# Altium project ESP32_Tang1.PrjPcb (part 1 of 2)
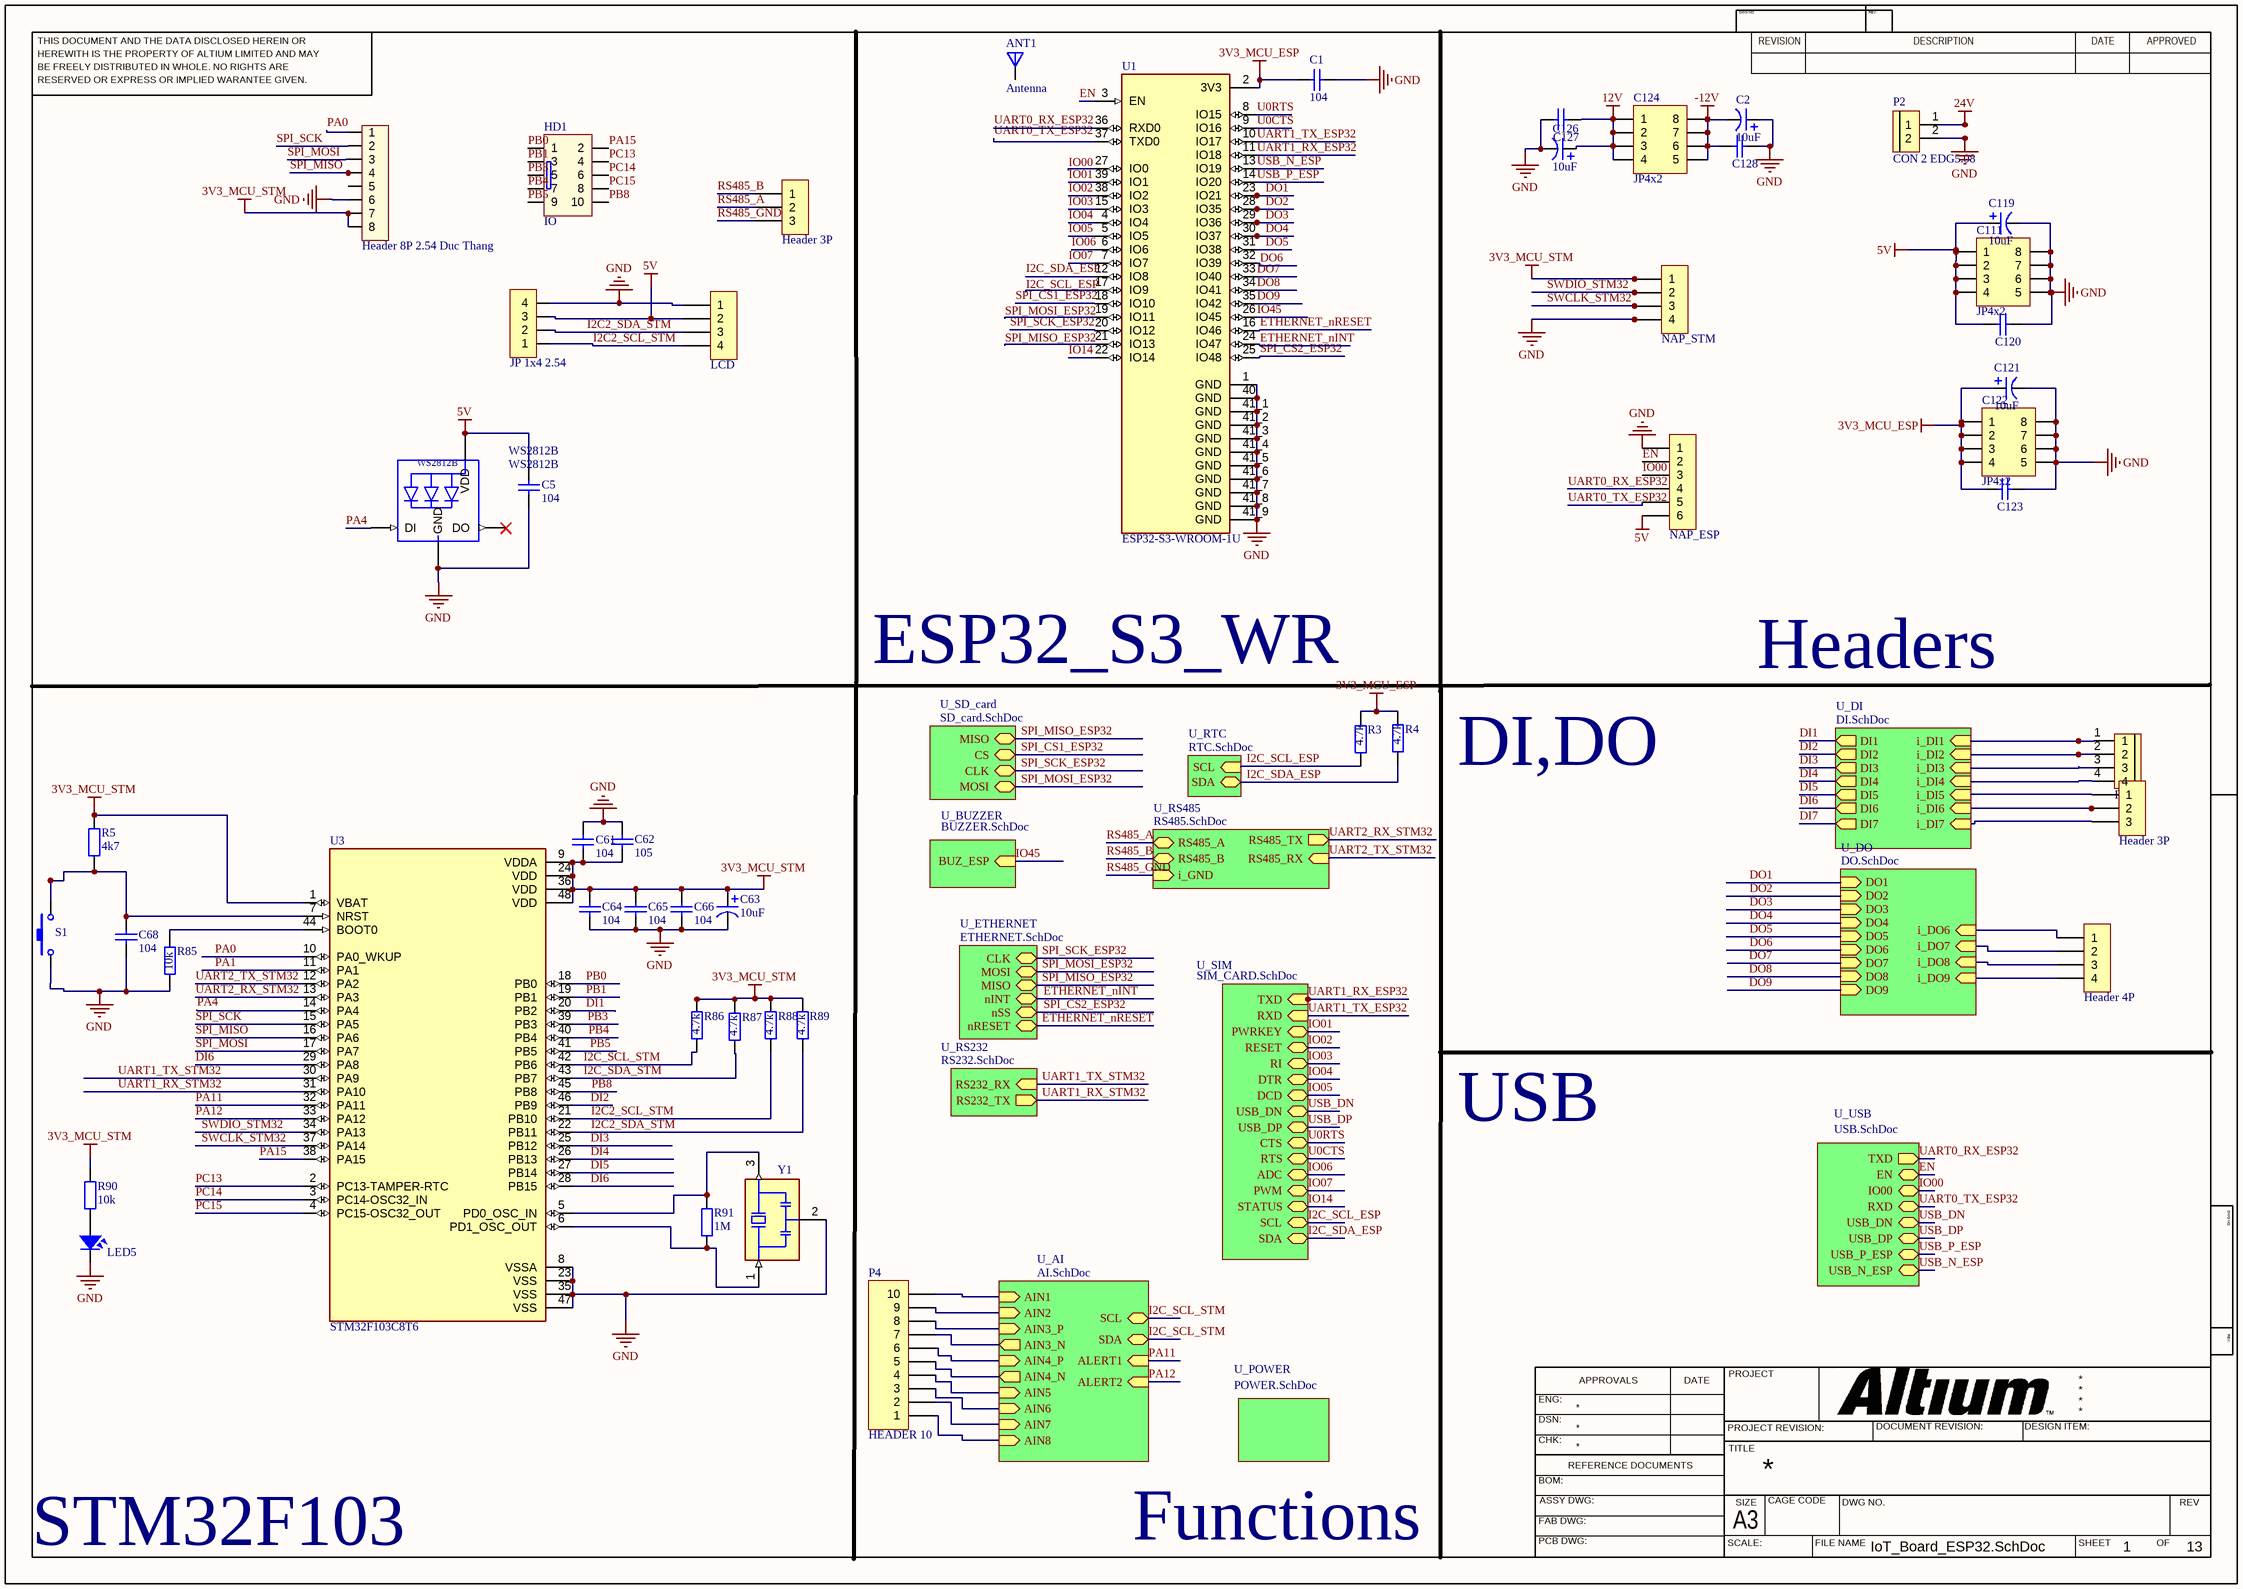
[diagram p0: IoT_Board_ESP32.SchDoc]
13 sheets, 439 parts. Net scope: hierarchical (ports join the sheet entries above them; power ports are global).
Board file: PCB_Board.PcbDoc
Sheets:
  IoT_Board_ESP32.SchDoc
    U_RTC = RTC.SchDoc
    U_DI = DI.SchDoc
    U_ETHERNET = ETHERNET.SchDoc
    U_POWER = POWER.SchDoc
    U_RS485 = RS485.SchDoc
    U_SD_card = SD_card.SchDoc
    U_DO = DO.SchDoc
    U_SIM = SIM_CARD.SchDoc
    U_AI = AI.SchDoc
    U_BUZZER = BUZZER.SchDoc
    U_RS232 = RS232.SchDoc
    U_USB = USB.SchDoc

## Sheet IoT_Board_ESP32.SchDoc
size 420 x 297 mm; SheetNumber: 1; SheetTotal: 13

### Parts
ANT1  Antenna  [ANTENNA]
C1  104  [0603_Cap]
C2  10uF  [1206_CAP]
C5  104  [0603_Cap]
C61  104  [0603_Cap]
C62  105  [0603_Cap]
C63  10uF  [1206_CAP]
C64  104  [0603_Cap]
C65  104  [0603_Cap]
C66  104  [0603_Cap]
C68  104  [0603_Cap]
C111  JP4x2  [JP4-D2T]
C119  10uF  [1206_CAP]
C120  105  [0805_Cap]  (value not drawn)
C121  10uF  [1206_CAP]
C122  JP4x2  [JP4-D2T]
C123  105  [0805_Cap]  (value not drawn)
C124  JP4x2  [JP4-D2T]
C126  10uF  [1206_CAP]
C127  105  [0805_Cap]  (value not drawn)
C128  105  [0805_Cap]  (value not drawn)
H1  NAP_ESP  [XH2.54M-6]
H2  Header 3P  [CON 3 EDG5.08-3P]
H3  NAP_STM  [XH2.54M-4]
H4  Header 8P 2.54 Duc Thang  [XH2.54M-8]
H5  LCD  [XH2.54M-4]
H7  Header 3P  [CON 3 EDG5.08-3P]
H25  Header 4P  [CON 4 EDG5.08-4P]
HD1  IO  [IDC10]
JP1  JP 1x4 2.54  [JP 1x4 DT]
LED5  LED  [0603_LED]  (value not drawn)
P2  CON 2 EDG5.08  [CON 2 2EDG5.08]
P3  CON 4 EDG5.08  [CON 4 4EDG5.08]  (value not drawn)
P4  HEADER 10  [HT508R-10P]
R3  4.7k  [0603_Res]
R4  4.7k  [0603_Res]
R5  4k7  [0603_Res]
R85  10k  [0603_Res]
R86  4.7k  [0603_Res]
R87  4.7k  [0603_Res]
R88  4.7k  [0603_Res]
R89  4.7k  [0603_Res]
R90  10k  [0603_Res]
R91  1M  [0603_Res]
S1  SW  [BUTTON-SMD 2PIN]  (value not drawn)
U1  ESP32-S3-WROOM-1U  [XCVR_ESP32-S3-WROOM-1U]
U3  STM32F103C8T6  [LQFP-48]
WS2812B  WS2812B  [WS2812B]
Y1  CSTCE8M00G52-R0  [OSC_CSTCE8M00G52-R0]  (value not drawn)

### Sub-sheets
U_AI = AI.SchDoc: AIN1 (in), SCL (bidir), SDA (bidir), AIN2 (in), AIN3_P (in), AIN3_N (out), AIN4_P (in), AIN4_N (out), AIN5 (in), AIN6 (in), ALERT1 (in), ALERT2 (in), AIN7 (in), AIN8 (in)
U_BUZZER = BUZZER.SchDoc: BUZ_ESP (in)
U_DI = DI.SchDoc: i_DI1 (in), i_DI2 (in), i_DI3 (in), i_DI4 (in), DI1 (out), DI2 (out), DI3 (out), DI4 (out), i_DI5 (in), i_DI6 (in), DI5 (out), DI6 (out), DI7 (out), i_DI7 (in)
U_DO = DO.SchDoc: DO6 (in), DO5 (in), DO4 (in), DO3 (in), DO2 (in), DO1 (in), DO7 (in), DO8 (in), DO9 (in), i_DO8 (in), i_DO9 (in), i_DO7 (in), i_DO6 (in)
U_ETHERNET = ETHERNET.SchDoc: nRESET (bidir), nSS (bidir), nINT (bidir), MISO (bidir), MOSI (bidir), CLK (bidir)
U_POWER = POWER.SchDoc: no entries
U_RS232 = RS232.SchDoc: RS232_RX (in), RS232_TX (out)
U_RS485 = RS485.SchDoc: RS485_A (bidir), RS485_B (bidir), RS485_TX (out), RS485_RX (in), i_GND (in)
U_RTC = RTC.SchDoc: SCL (in), SDA (bidir)
U_SD_card = SD_card.SchDoc: CS (bidir), MOSI (bidir), CLK (bidir), MISO (bidir)
U_SIM = SIM_CARD.SchDoc: RXD (in), PWRKEY (bidir), RESET (bidir), RI (bidir), DTR (bidir), DCD (bidir), USB_DN (bidir), USB_DP (bidir), TXD (in), CTS (bidir), RTS (bidir), ADC (bidir), PWM (bidir), STATUS (bidir), SCL (bidir), SDA (bidir)
U_USB = USB.SchDoc: TXD (out), EN (bidir), IO00 (bidir), RXD (bidir), USB_DN (bidir), USB_DP (bidir), USB_P_ESP (bidir), USB_N_ESP (bidir)

### Nets
3V3_MCU_ESP: C1.2 C121.1 C122.1 C122.2 C122.3 C122.4 C123.1 R3.2 R4.2 U1.2(3V3)
3V3_MCU_STM: C61.2 C62.2 C63.1 C64.1 C65.1 C66.1 H3.1 H4.7 H4.8 R5.2 R86.2 R87.2 R88.2 R89.2 R90.2 U3.1(VBAT) U3.9(VDDA) U3.24(VDD) U3.36(VDD) U3.48(VDD)
5V: C5.1 C111.1 C111.2 C111.3 C111.4 C119.1 C120.1 H1.6 H5.2 JP1.3 WS2812B.1-VDD(VDD)
12V: C124.1 C124.2 C124.3 C124.4 C126.1 C127.1
24V: P2.1
-12V: C2.2 C124.5 C124.6 C124.7 C124.8 C128.1
AGND: P4.5 P4.7 ; sheet U_AI/AIN3_N, sheet U_AI/AIN4_N
GND: C1.1 C2.1 C5.2 C61.1 C62.1 C63.2 C64.2 C65.2 C66.2 C68.1 C111.5 C111.6 C111.7 C111.8 C119.2 C120.2 C121.2 C122.5 C122.6 C122.7 C122.8 C123.2 C126.2 C127.2 C128.2 H1.1 H3.4 H4.6 H5.1 JP1.4 LED5.C(Cathode) P2.2 R85.1 S1.1 U1.1(GND) U1.40(GND) U1.41_1(GND) U1.41_2(GND) U1.41_3(GND) U1.41_4(GND) U1.41_5(GND) U1.41_6(GND) U1.41_7(GND) U1.41_8(GND) U1.41_9(GND) U3.8(VSSA) U3.23(VSS) U3.35(VSS) U3.47(VSS) WS2812B.3-GND(GND) Y1.2(GND)
AIN5: P4.4 ; sheet U_AI/AIN5
AIN6: P4.3 ; sheet U_AI/AIN6
AIN7: P4.2 ; sheet U_AI/AIN7
AIN8: P4.1 ; sheet U_AI/AIN8
DI1: U3.20(PB2) ; sheet U_DI/DI1
DI2: U3.46(PB9) ; sheet U_DI/DI2
DI3: U3.25(PB12) ; sheet U_DI/DI3
DI4: U3.26(PB13) ; sheet U_DI/DI4
DI5: U3.27(PB14) ; sheet U_DI/DI5
DI6: U3.28(PB15) U3.29(PA8) ; sheet U_DI/DI6
DO1: U1.23(IO21) ; sheet U_DO/DO1
DO2: U1.28(IO35) ; sheet U_DO/DO2
DO3: U1.29(IO36) ; sheet U_DO/DO3
DO4: U1.30(IO37) ; sheet U_DO/DO4
DO5: U1.31(IO38) ; sheet U_DO/DO5
DO6: U1.32(IO39) ; sheet U_DO/DO6
DO7: U1.33(IO40) ; sheet U_DO/DO7
DO8: U1.34(IO41) ; sheet U_DO/DO8
DO9: U1.35(IO42) ; sheet U_DO/DO9
EN: H1.2 U1.3(EN) ; sheet U_USB/EN
ETHERNET_nINT: U1.24(IO47) ; sheet U_ETHERNET/nINT
ETHERNET_nRESET: U1.16(IO46) ; sheet U_ETHERNET/nRESET
I2C2_SCL_STM: H5.4 JP1.1 R88.1 U3.21(PB10)
I2C2_SDA_STM: H5.3 JP1.2 R89.1 U3.22(PB11)
I2C_SCL_ESP: R3.1 U1.17(IO9) ; sheet U_RTC/SCL, sheet U_SIM/SCL
I2C_SCL_STM: R86.1 U3.42(PB6) ; sheet U_AI/SCL, sheet U_AI/SDA
I2C_SDA_ESP: R4.1 U1.12(IO8) ; sheet U_RTC/SDA, sheet U_SIM/SDA
I2C_SDA_STM: R87.1 U3.43(PB7)
IO00: H1.3 U1.27(IO0) ; sheet U_USB/IO00
IO01: U1.39(IO1) ; sheet U_SIM/PWRKEY
IO02: U1.38(IO2) ; sheet U_SIM/RESET
IO03: U1.15(IO3) ; sheet U_SIM/RI
IO04: U1.4(IO4) ; sheet U_SIM/DTR
IO05: U1.5(IO5) ; sheet U_SIM/DCD
IO06: U1.6(IO6) ; sheet U_SIM/ADC
IO07: U1.7(IO7) ; sheet U_SIM/PWM
IO14: U1.22(IO14) ; sheet U_SIM/STATUS
IO45: U1.26(IO45) ; sheet U_BUZZER/BUZ_ESP
PA0: H4.1 U3.10(PA0_WKUP)
PA1: U3.11(PA1)
PA4: U3.14(PA4) WS2812B.4-DIN(DI)
PA11: U3.32(PA11) ; sheet U_AI/ALERT1
PA12: U3.33(PA12) ; sheet U_AI/ALERT2
PA15: HD1.2 U3.38(PA15)
PB0: HD1.1 U3.18(PB0)
PB1: HD1.3 U3.19(PB1)
PB3: HD1.5 U3.39(PB3)
PB4: HD1.7 U3.40(PB4)
PB5: HD1.9 U3.41(PB5)
PB8: HD1.10 U3.45(PB8)
PC13: HD1.4 U3.2(PC13-TAMPER-RTC)
PC14: HD1.6 U3.3(PC14-OSC32_IN)
PC15: HD1.8 U3.4(PC15-OSC32_OUT)
RS485_A: H7.2 ; sheet U_RS485/RS485_A
RS485_B: H7.1 ; sheet U_RS485/RS485_B
RS485_GND: H7.3 ; sheet U_RS485/i_GND
SPI_CS1_ESP32: U1.18(IO10) ; sheet U_SD_card/CS
SPI_CS2_ESP32: U1.25(IO48) ; sheet U_ETHERNET/nSS
SPI_MISO: H4.4 U3.16(PA6)
SPI_MISO_ESP32: U1.21(IO13) ; sheet U_ETHERNET/MISO, sheet U_SD_card/MISO
SPI_MOSI: H4.3 U3.17(PA7)
SPI_MOSI_ESP32: U1.19(IO11) ; sheet U_ETHERNET/MOSI, sheet U_SD_card/MOSI
SPI_SCK: H4.2 U3.15(PA5)
SPI_SCK_ESP32: U1.20(IO12) ; sheet U_ETHERNET/CLK, sheet U_SD_card/CLK
SWCLK_STM32: H3.3 U3.37(PA14)
SWDIO_STM32: H3.2 U3.34(PA13)
U0CTS: U1.9(IO16) ; sheet U_SIM/RTS
U0RTS: U1.8(IO15) ; sheet U_SIM/CTS
UART0_RX_ESP32: H1.4 U1.36(RXD0) ; sheet U_USB/TXD
UART0_TX_ESP32: H1.5 U1.37(TXD0) ; sheet U_USB/RXD
UART1_RX_ESP32: U1.11(IO18) ; sheet U_SIM/TXD
UART1_RX_STM32: U3.31(PA10) ; sheet U_RS232/RS232_TX
UART1_TX_ESP32: U1.10(IO17) ; sheet U_SIM/RXD
UART1_TX_STM32: U3.30(PA9) ; sheet U_RS232/RS232_RX
UART2_RX_STM32: U3.13(PA3) ; sheet U_RS485/RS485_TX
UART2_TX_STM32: U3.12(PA2) ; sheet U_RS485/RS485_RX
USB_DN: sheet U_SIM/USB_DN, sheet U_USB/USB_DN
USB_DP: sheet U_SIM/USB_DP, sheet U_USB/USB_DP
USB_N_ESP: U1.13(IO19) ; sheet U_USB/USB_N_ESP
USB_P_ESP: U1.14(IO20) ; sheet U_USB/USB_P_ESP
NetC68_2: C68.2 R5.1 S1.2 U3.7(NRST)
NetC91_2: P4.10 ; sheet U_AI/AIN1
NetC96_1: P4.9 ; sheet U_AI/AIN2
NetC104_1: P4.8 ; sheet U_AI/AIN3_P
NetC109_1: P4.6 ; sheet U_AI/AIN4_P
NetD1_2: H25.3 ; sheet U_DO/i_DO8
NetD6_2: H25.4 ; sheet U_DO/i_DO9
NetD12_2: H25.1 ; sheet U_DO/i_DO6
NetD13_2: H25.2 ; sheet U_DO/i_DO7
NetH2_1: H2.1 ; sheet U_DI/i_DI5
NetH2_2: H2.2 ; sheet U_DI/i_DI6
NetH2_3: H2.3 ; sheet U_DI/i_DI7
NetLED5_A: LED5.A(Anode) R90.1
NetP3_1: P3.1 ; sheet U_DI/i_DI1
NetP3_2: P3.2 ; sheet U_DI/i_DI2
NetP3_3: P3.3 ; sheet U_DI/i_DI3
NetP3_4: P3.4 ; sheet U_DI/i_DI4
NetR85_2: R85.2 U3.44(BOOT0)
NetR91_1: R91.1 U3.6(PD1_OSC_OUT) Y1.1(IN)
NetR91_2: R91.2 U3.5(PD0_OSC_IN) Y1.3(OUT)

Not connected (* = marked no-connect by the designer): ANT1 1(ANT); H4 5; WS2812B 2-DOUT(DO)

### Notes on the sheet
- ESP32_S3_WR
- Headers
- DI,DO
- USB
- STM32F103
- Functions
- THIS DOCUMENT AND THE DATA DISCLOSED HEREIN OR
- HEREWITH IS THE PROPERTY OF ALTIUM LIMITED AND MAY
- DWG NO:
- REVISION
- REV:
- DESCRIPTION
- DATE
- APPROVED
- BE FREELY DISTRIBUTED IN WHOLE. NO RIGHTS ARE
- RESERVED OR EXPRESS OR IMPLIED WARANTEE GIVEN.
- ENG:
- APPROVALS
- PROJECT
- DSN:
- CHK:
- REFERENCE DOCUMENTS
- PROJECT REVISION:
- TITLE
- DOCUMENT REVISION:
- DESIGN ITEM:
- BOM:
- FAB DWG:
- PCB DWG:
- ASSY DWG:
- SCALE:
- A3
- SIZE
- CAGE CODE
- FILE NAME
- DWG NO.
- SHEET
- OF
- REV

### Library data of the parts
C1 C5 C61 C62 C64-C66 C68 C120 C123 C127 C128 = Ceramic Capacitor: Chung_Loai: Dán; Don_Vi: Con; So_Chan: 2; Ten_Linh_Kien: Tụ 0805 104-100nF 10% 50V; Ma_Hang: MH004551; Kieu_Chan: *
C2 C63 C119 C121 C126 = Polarized Capacitor
C111 C122 C124 = JP4x2: WR-PHD 2.54 mm Dual Socket Header; Manufacturer: W¨¹rth Elektronik eiSos GmbH; partNo: 61300821821; ComponentLink1 Description: Manufacturer; ComponentLink2 Description: Datasheet; NoPins: 08; Created Date: 29 March 2013; ComponentLink1URL: http://www.we-online.com; ComponentLink2URL: http://katalog.we-online.de/em/datasheet/6130xx21821.pdf; Created by: Karrer Zheng
H1 = Header 6P: THT; Ten_Linh_Kien: Header 6P XH2.54-6P Đực Cong; Don_Vi: Con; Ma_Hang: MH003363; Chung_Loai: Cắm
H2 H7 = Header 3P: THT; Ten_Linh_Kien: Header 3P XH2.54-3P Đực Cong; Don_Vi: Con; Ma_Hang: MH001302; Chung_Loai: Cắm
H3 H5 = Header 4P 2.54 Duc Thang: Cắm; Ten_Linh_Kien: Header 4P XH2.54-4P Đực Thẳng; Don_Vi: Con; Ma_Hang: MH001285; Chung_Loai: Cắm
H4 = Header 8P 2.54 Duc Thang: Cắm; Ten_Linh_Kien: Header 8P XH2.54-8P Đực Thẳng; Don_Vi: Con; Ma_Hang: MH003366; Chung_Loai: Cắm
H25 = Header 4P: THT; Ten_Linh_Kien: Header 4P XH2.54-4P Đực Cong; Don_Vi: Con; Ma_Hang: MH001310; Chung_Loai: Cắm
HD1 = IDC 5X2: Value: Header 5x2
JP1 = JP 1x4 2.54 Duc Thang: Cắm; Ten_Linh_Kien: Jump Đơn Đực 2.54MM 1x40P Thẳng 11MM; Don_Vi: Con; Ma_Hang: MH000903; Ghi_Chu: *; Kieu_Chan: *; Chung_Loai: Cắm
LED5 = LED: LED single color 2 leads
P2 = CON 2 EDG5.08: Cắm; Ten_Linh_Kien: CON 2 2EDG5.08-2P 5.08MM ( Xanh Cong); Ma_Hang: MH000759; Ghi_Chu: *; Don_Vi: Con; Kieu_Chan: *; Chung_Loai: Cắm
P3 = CON 4 EDG5.08: Cắm; Ten_Linh_Kien: CON 4 2EDG5.08-4P 5.08MM ( Xanh Cong); Ma_Hang: MH000979; Don_Vi: Con; Ghi_Chu: *; Kieu_Chan: *; Chung_Loai: Cắm
R3-R5 R85-R91 = Resistor: Chung_Loai: Dán; Don_Vi: Con; So_Chan: 2; Ten_Linh_Kien: Trở 0805 1% 1k; Ma_Hang: MH005468; Kieu_Chan: *
S1 = SW-Button: Switch-Button; Published: 24-Mar-1999; LatestRevisionDate: 17-Jul-2002; LatestRevisionNote: Re-released for DXP Platform.; PackageReference: SPST-2; Publisher: Altium Limited
U1 = ESP32-S3-WROOM-1U: 2.4 GHz Wi-Fi (802.11 b/g/n) and Bluetooth 5 (LE) module; MF: Espressif Systems; Value: *; Package: Package; Check_prices: https://www.snapeda.com/parts/ESP32-S3-WROOM-1U/Espressif+Systems/view-part/?ref=eda; Price: None; MP: ESP32-S3-WROOM-1U; Availability: Not in stock; SnapEDA_Link: https://www.snapeda.com/parts/ESP32-S3-WROOM-1U/Espressif+Systems/view-part/?ref=snap
U3 = STM32F103C8T6: ARMÂ® CortexÂ®-M3 STM32F1 Microcontroller IC 32-Bit 72MHz 64KB (64K x 8) FLASH 48-LQFP (7x7); MF: STMicroelectronics; Price: None; Availability: In Stock; MP: STM32F103C8T6; Package: LQFP-48 STMicroelectronics; SnapEDA_Link: https://www.snapeda.com/parts/STM32F103C8T6/STMicroelectronics/view-part/?ref=snap; Check_prices: https://www.snapeda.com/parts/STM32F103C8T6/STMicroelectronics/view-part/?ref=eda; Value: *; Purchase-URL: https://pricing.snapeda.com/search/part/STM32F103C8T6/?ref=eda
Y1 = CSTCE8M00G52-R0: 8MHz Ceramic Resonator Built in Capacitor 10pF Â±0.2% -20Â°C ~ 80Â°C Surface Mount; MF: Murata; Price: None; Check_prices: https://www.snapeda.com/parts/CSTCE8M00G52-R0/Murata%20Electronics%20North%20America/view-part/234504/?ref=eda; SnapEDA_Link: https://www.snapeda.com/parts/CSTCE8M00G52-R0/Murata%20Electronics%20North%20America/view-part/234504/?ref=snap; Package: Surface Mount Murata Electronics North America; Availability: Bad; MP: CSTCE8M00G52-R0; Value: *

## Sheet RTC.SchDoc
size A; SheetNumber: 6; SheetTotal: 13
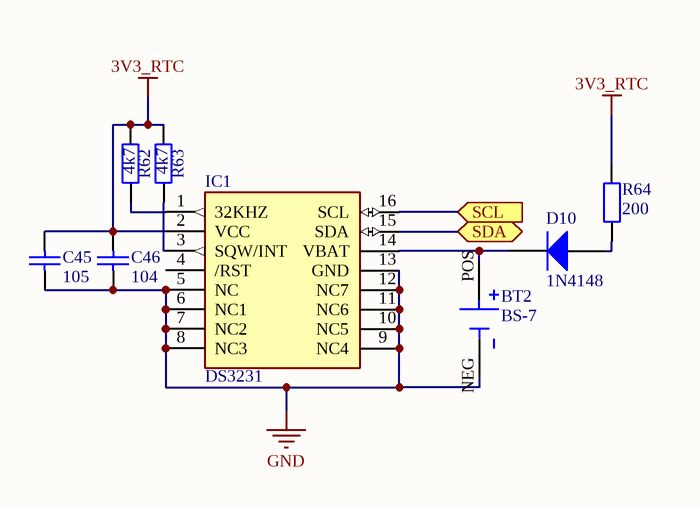
[diagram p1: RTC.SchDoc]

### Parts
BT2  BS-7  [BAT_BS-7]
C45  105  [0603_Cap]
C46  104  [0603_Cap]
D10  1N4148  [SOD-323]
IC1  DS3231  [SOIC-16]  (value not drawn)
R62  4k7  [0603_Res]
R63  4k7  [0603_Res]
R64  200  [0603_Res]

### Ports
SCL (in), SDA (bidir)

### Nets
3V3_RTC: C45.1 C46.1 IC1.2(VCC) R62.2 R63.2 R64.1
GND: BT2.NEG C45.2 C46.2 IC1.5(NC) IC1.6(NC1) IC1.7(NC2) IC1.8(NC3) IC1.9(NC4) IC1.10(NC5) IC1.11(NC6) IC1.12(NC7) IC1.13(GND)
I2C_SCL_ESP: IC1.16(SCL) ; port SCL
I2C_SDA_ESP: IC1.15(SDA) ; port SDA
NetBT2_POS: BT2.POS D10.1 IC1.14(VBAT)
NetD10_2: D10.2 R64.2
NetIC1_1: IC1.1(32KHZ) R62.1
NetIC1_3: IC1.3(SQW/INT) R63.1

Not connected (* = marked no-connect by the designer): IC1 4(/RST)

### Library data of the parts
BT2 = BS-7: Battery Holder (Open) Coin, 20.0mm 1 Cell PC Pin; MF: MPD (Memory; SnapEDA_Link: https://www.snapeda.com/parts/BS-7/MPD+%2528Memory+Protection+Devices%2529/view-part/?ref=snap; Package: None; MP: BS-7; Check_prices: https://www.snapeda.com/parts/BS-7/MPD+%2528Memory+Protection+Devices%2529/view-part/?ref=eda; Purchase-URL: https://pricing.snapeda.com/search/part/BS-7/?ref=eda; Digi-Key_Part_Number: BS-7-ND; Value: *
C45 C46 = Ceramic Capacitor: as C1 on sheet IoT_Board_ESP32; Kieu_Chan: *
D10 = Diode: Ten_Linh_Kien: Diode S4 SOD123 ( 1N5819 SOD123); Ma_Hang: MH005519; Chung_Loai: Dán; Don_Vi: Con; Ghi_Chu: *; Kieu_Chan: *
IC1 = DS3231: Real Time Clock (RTC) IC Clock/Calendar - IÂ²C, 2-Wire Serial 8-SOIC (0.154, 3.90mm Width); MF: Maxim Integrated; Check_prices: https://www.snapeda.com/parts/DS3231/Maxim+Integrated/view-part/?ref=eda; Value: *; Availability: In Stock; MP: DS3231; Price: None; Package: SOIC-16 Maxim Integrated; SnapEDA_Link: https://www.snapeda.com/parts/DS3231/Maxim+Integrated/view-part/?ref=snap; Purchase-URL: https://pricing.snapeda.com/search/part/DS3231/?ref=eda
R62-R64 = Resistor: as R3 on sheet IoT_Board_ESP32; Kieu_Chan: *

## Sheet DI.SchDoc
size A; SheetNumber: 4; SheetTotal: 13
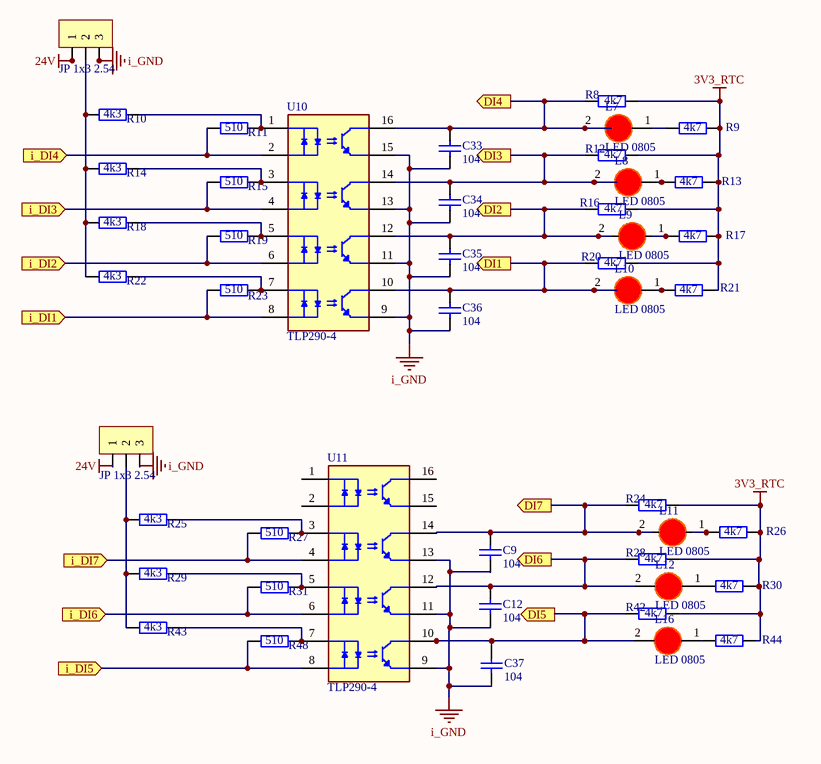
[diagram p2: DI.SchDoc]

### Parts
C9  104  [0603_Cap]
C12  104  [0603_Cap]
C33  104  [0603_Cap]
C34  104  [0603_Cap]
C35  104  [0603_Cap]
C36  104  [0603_Cap]
C37  104  [0603_Cap]
JP3  JP 1x3 2.54  [JP 1x3 DT]
JP4  JP 1x3 2.54  [JP 1x3 DT]
L7  LED 0805  [LED-1206-Red]
L8  LED 0805  [LED-1206-Red]
L9  LED 0805  [LED-1206-Red]
L10  LED 0805  [LED-1206-Red]
L11  LED 0805  [LED-1206-Red]
L12  LED 0805  [LED-1206-Red]
L16  LED 0805  [LED-1206-Red]
R8  4k7  [0603_Res]
R9  4k7  [0603_Res]
R10  4k3  [0603_Res]
R11  510  [0603_Res]
R12  4k7  [0603_Res]
R13  4k7  [0603_Res]
R14  4k3  [0603_Res]
R15  510  [0603_Res]
R16  4k7  [0603_Res]
R17  4k7  [0603_Res]
R18  4k3  [0603_Res]
R19  510  [0603_Res]
R20  4k7  [0603_Res]
R21  4k7  [0603_Res]
R22  4k3  [0603_Res]
R23  510  [0603_Res]
R24  4k7  [0603_Res]
R25  4k3  [0603_Res]
R26  4k7  [0603_Res]
R27  510  [0603_Res]
R28  4k7  [0603_Res]
R29  4k3  [0603_Res]
R30  4k7  [0603_Res]
R31  510  [0603_Res]
R42  4k7  [0603_Res]
R43  4k3  [0603_Res]
R44  4k7  [0603_Res]
R48  510  [0603_Res]
U10  TLP290-4  [OPTO_TLP290-4]
U11  TLP290-4  [OPTO_TLP290-4]

### Ports
DI1 (out), DI2 (out), DI3 (out), DI4 (out), DI5 (out), DI6 (out), DI7 (out), i_DI1 (in), i_DI2 (in), i_DI3 (in), i_DI4 (in), i_DI5 (in), i_DI6 (in), i_DI7 (in)

### Nets
3V3_RTC: R8.2 R9.2 R12.2 R13.2 R16.2 R17.2 R20.2 R21.2 R24.2 R26.2 R28.2 R30.2 R42.2 R44.2
24V: JP3.1 JP4.1
i_GND: C9.2 C12.2 C33.2 C34.2 C35.2 C36.2 C37.2 JP3.3 JP4.3 U10.9 U10.11 U10.13 U10.15 U11.9 U11.11 U11.13
DI1: C36.1 L10.2(K) R20.1 U10.10 ; port DI1
DI2: C35.1 L9.2(K) R16.1 U10.12 ; port DI2
DI3: C34.1 L8.2(K) R12.1 U10.14 ; port DI3
DI4: C33.1 L7.2(K) R8.1 U10.16 ; port DI4
DI5: C37.1 L16.2(K) R42.1 U11.10 ; port DI5
DI6: C12.1 L12.2(K) R28.1 U11.12 ; port DI6
DI7: C9.1 L11.2(K) R24.1 U11.14 ; port DI7
NetH2_1: R48.2 U11.8 ; port i_DI5
NetH2_2: R31.2 U11.6 ; port i_DI6
NetH2_3: R27.2 U11.4 ; port i_DI7
NetJP3_2: JP3.2 R10.1 R14.1 R18.1 R22.1
NetJP4_2: JP4.2 R25.1 R29.1 R43.1
NetL7_1: L7.1(A) R9.1
NetL8_1: L8.1(A) R13.1
NetL9_1: L9.1(A) R17.1
NetL10_1: L10.1(A) R21.1
NetL11_1: L11.1(A) R26.1
NetL12_1: L12.1(A) R30.1
NetL16_1: L16.1(A) R44.1
NetP3_1: R23.2 U10.8 ; port i_DI1
NetP3_2: R19.2 U10.6 ; port i_DI2
NetP3_3: R15.2 U10.4 ; port i_DI3
NetP3_4: R11.2 U10.2 ; port i_DI4
NetR10_2: R10.2 R11.1 U10.1
NetR14_2: R14.2 R15.1 U10.3
NetR18_2: R18.2 R19.1 U10.5
NetR22_2: R22.2 R23.1 U10.7
NetR25_2: R25.2 R27.1 U11.3
NetR29_2: R29.2 R31.1 U11.5
NetR43_2: R43.2 R48.1 U11.7

Not connected (* = marked no-connect by the designer): U11 1 2 15 16

### Library data of the parts
C9 C12 C33-C37 = Ceramic Capacitor: as C1 on sheet IoT_Board_ESP32; Kieu_Chan: *
JP3 JP4 = JP 1x3 2.54 Duc Thang: Cắm; Ten_Linh_Kien: Jump Đơn Đực 2.54MM 1x40P Thẳng 11MM; Don_Vi: Con; Ma_Hang: MH000903; Ghi_Chu: *; Kieu_Chan: *; Chung_Loai: Cắm
L7-L12 L16 = LED 1206 Do: Dán; Don_Vi: Con; Ma_Hang: MH002334; Ten_Linh_Kien: LED1206 Màu Đỏ (Red); Ghi_Chu: *; Kieu_Chan: *; Chung_Loai: Dán
R8-R31 R42-R44 R48 = Resistor: as R3 on sheet IoT_Board_ESP32; Kieu_Chan: *
U10 U11 = TLP290-4: Optoisolator Transistor Output 2500Vrms 4 Channel 16-SO; MF: Toshiba Semiconductor; Value: *; SnapEDA_Link: https://www.snapeda.com/parts/TLP290-4/Toshiba+Semiconductor+and+Storage/view-part/?ref=snap; MP: TLP290-4; Check_prices: https://www.snapeda.com/parts/TLP290-4/Toshiba+Semiconductor+and+Storage/view-part/?ref=eda; Availability: Not in stock; Price: None; Package: SOIC-16 Toshiba

## Sheet ETHERNET.SchDoc
size A; SheetNumber: 10; SheetTotal: 10
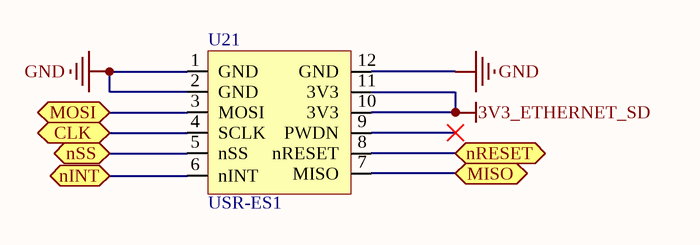
[diagram p3: ETHERNET.SchDoc]

### Parts
U21  USR-ES1  [USR-ES1]

### Ports
CLK (bidir), MISO (bidir), MOSI (bidir), nINT (bidir), nRESET (bidir), nSS (bidir)

### Nets
3V3_ETHERNET_SD: U21.10(3V3) U21.11(3V3)
GND: U21.1(GND) U21.2(GND) U21.12(GND)
ETHERNET_nINT: U21.6(nINT) ; port nINT
ETHERNET_nRESET: U21.8(nRESET) ; port nRESET
SPI_CS2_ESP32: U21.5(nSS) ; port nSS
SPI_MISO_ESP32: U21.7(MISO) ; port MISO
SPI_MOSI_ESP32: U21.3(MOSI) ; port MOSI
SPI_SCK_ESP32: U21.4(SCLK) ; port CLK

Not connected (* = marked no-connect by the designer): U21 9(PWDN)*

### Library data of the parts
U21 = USR-ES1: Ethernet module

## Sheet POWER.SchDoc
size 420 x 297 mm; SheetNumber: 3; SheetTotal: 13
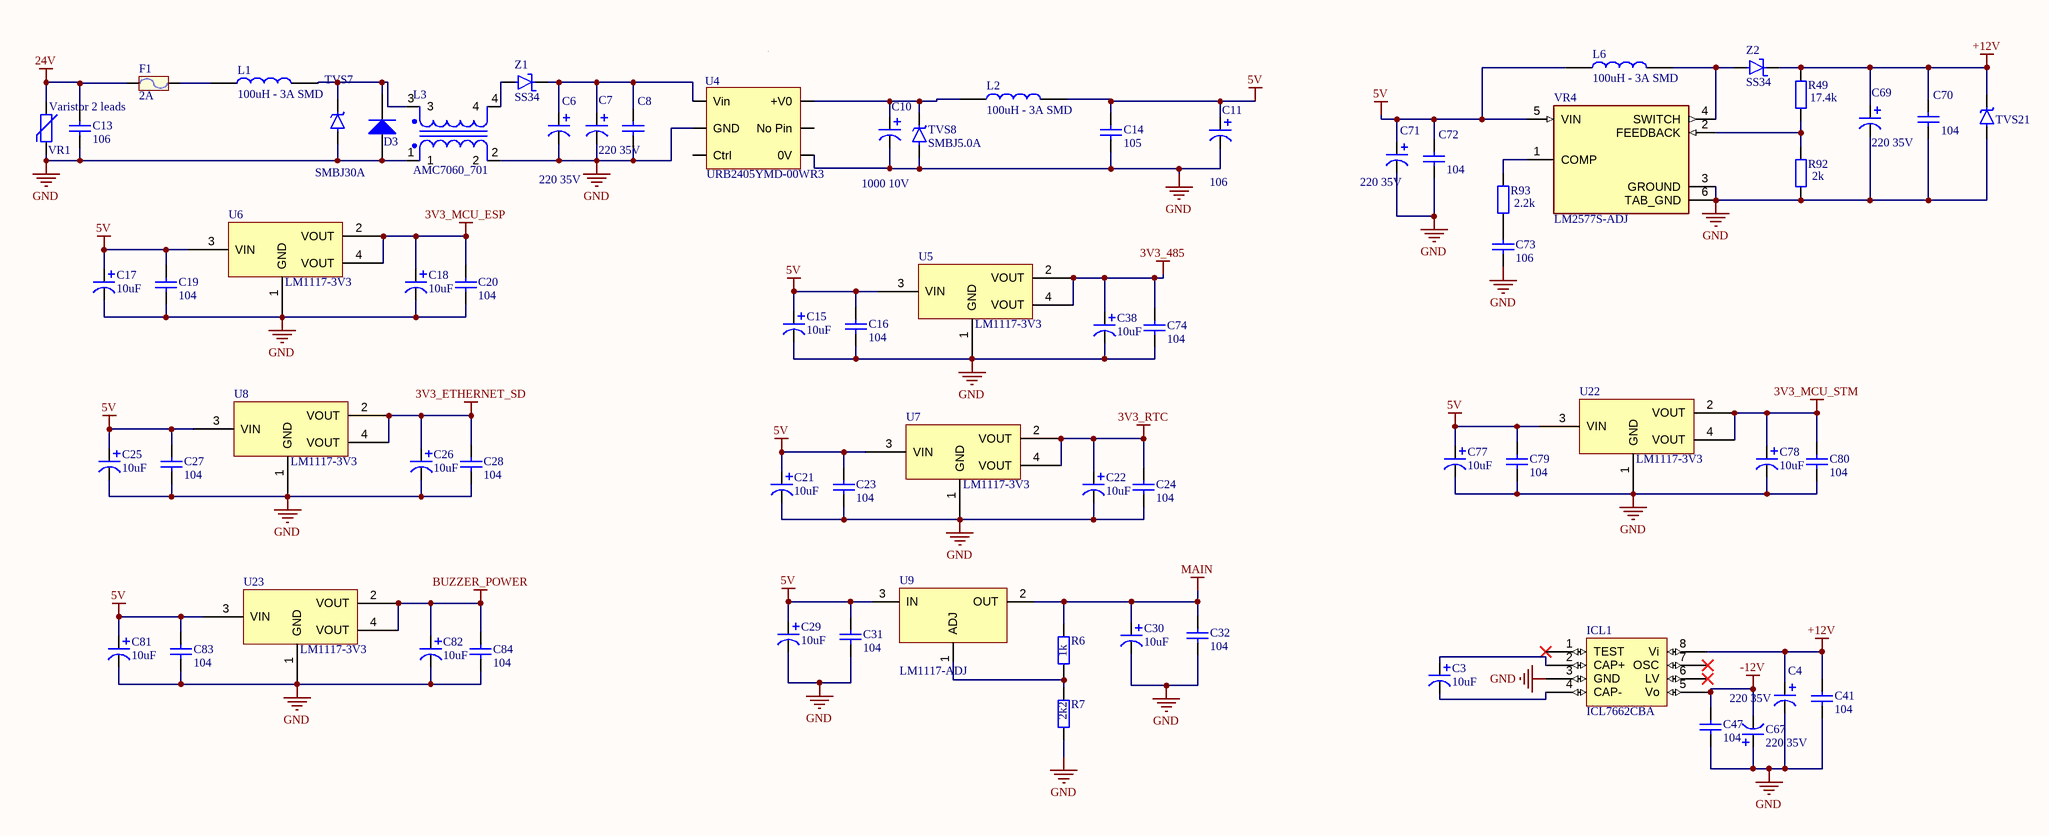
[diagram p4: POWER.SchDoc]

### Parts
C3  10uF  [1206_CAP]
C4  220 35V  [8x12 radial capacitor]
C6  220 35V  [8x12 radial capacitor]
C7  220 35V  [8x12 radial capacitor]
C8  105  [0805_Cap]  (value not drawn)
C10  1000 10V  [8x12 radial capacitor]
C11  106  [1206_CAP]
C13  106  [1206_CAP]
C14  105  [1206_CAP]
C15  10uF  [1206_CAP]
C16  104  [0603_Cap]
C17  10uF  [1206_CAP]
C18  10uF  [1206_CAP]
C19  104  [0603_Cap]
C20  104  [0603_Cap]
C21  10uF  [1206_CAP]
C22  10uF  [1206_CAP]
C23  104  [0603_Cap]
C24  104  [0603_Cap]
C25  10uF  [1206_CAP]
C26  10uF  [1206_CAP]
C27  104  [0603_Cap]
C28  104  [0603_Cap]
C29  10uF  [1206_CAP]
C30  10uF  [1206_CAP]
C31  104  [0603_Cap]
C32  104  [0603_Cap]
C38  10uF  [1206_CAP]
C41  104  [0603_Cap]
C47  104  [0603_Cap]
C67  220 35V  [8x12 radial capacitor]
C69  220 35V  [8x12 radial capacitor]
C70  104  [0805_Cap]
C71  220 35V  [8x12 radial capacitor]
C72  104  [0805_Cap]
C73  106  [1206_CAP]
C74  104  [0603_Cap]
C77  10uF  [1206_CAP]
C78  10uF  [1206_CAP]
C79  104  [0603_Cap]
C80  104  [0603_Cap]
C81  10uF  [1206_CAP]
C82  10uF  [1206_CAP]
C83  104  [0603_Cap]
C84  104  [0603_Cap]
D3  RS3M  [SMC - DO-214]  (value not drawn)
F1  2A  [Fuse4]
ICL1  ICL7662CBA  [ICL7662CBA]
L1  100uH - 3A SMD  [Cuon Cam 12x12x10]
L2  100uH - 3A SMD  [Cuon Cam 12x12x10]
L3  AMC7060_701  [Double inductor]
L6  100uH - 3A SMD  [Cuon Cam 12x12x10]
R6  1k  [0603_Res]
R7  2k2  [0603_Res]
R49  17.4k  [0603_Res]
R92  2k  [0603_Res]
R93  2.2k  [0603_Res]
TVS7  SMBJ30A  [SMC - DO-214]
TVS8  SMBJ5.0A  [SMB - DO-214AA]
TVS21  SMBJ30A  [SMC - DO-214]  (value not drawn)
U4  URB2405YMD-00WR3  [URB2405YMD-xxWR3]
U5  LM1117-3V3  [SOT-223]
U6  LM1117-3V3  [SOT-223]
U7  LM1117-3V3  [SOT-223]
U8  LM1117-3V3  [SOT-223]
U9  LM1117-ADJ  [LM1117-SOP]
U22  LM1117-3V3  [SOT-223]
U23  LM1117-3V3  [SOT-223]
VR1  Varistor 2 leads  [Varistor]
VR4  LM2577S-ADJ  [TO170P1524X483-6N]
Z1  SS34  [SMB - DO-214AA]
Z2  SS34  [SMB - DO-214AA]

### Nets
3V3_485: C38.1 C74.1 U5.2(VOUT) U5.4(VOUT)
3V3_ETHERNET_SD: C26.1 C28.1 U8.2(VOUT) U8.4(VOUT)
3V3_MCU_ESP: C18.1 C20.1 U6.2(VOUT) U6.4(VOUT)
3V3_MCU_STM: C78.1 C80.1 U22.2(VOUT) U22.4(VOUT)
3V3_RTC: C22.1 C24.1 U7.2(VOUT) U7.4(VOUT)
5V: C11.1 C14.1 C15.1 C16.1 C17.1 C19.1 C21.1 C23.1 C25.1 C27.1 C29.1 C31.1 C71.1 C72.1 C77.1 C79.1 C81.1 C83.1 L2.2 L6.1 U5.3(VIN) U6.3(VIN) U7.3(VIN) U8.3(VIN) U9.3(IN) U22.3(VIN) U23.3(VIN) VR4.5(VIN)
24V: C13.1 F1.1 VR1.1
+12V: C4.1 C41.1 C69.1 C70.1 ICL1.8(Vi) R49.2 TVS21.1 Z2.1
-12V: C47.1 C67.2 ICL1.5(Vo)
BUZZER_POWER: C82.1 C84.1 U23.2(VOUT) U23.4(VOUT)
GND: C4.2 C6.2 C7.2 C8.2 C10.2 C11.2 C13.2 C14.2 C15.2 C16.2 C17.2 C18.2 C19.2 C20.2 C21.2 C22.2 C23.2 C24.2 C25.2 C26.2 C27.2 C28.2 C29.2 C30.2 C31.2 C32.2 C38.2 C41.2 C47.2 C67.1 C69.2 C70.2 C71.2 C72.2 C73.2 C74.2 C77.2 C78.2 C79.2 C80.2 C81.2 C82.2 C83.2 C84.2 D3.2 ICL1.3(GND) L3.1 L3.2 R7.1 R92.1 TVS7.2 TVS8.2 TVS21.2 U4.2(GND) U4.6(0V) U5.1(GND) U6.1(GND) U7.1(GND) U8.1(GND) U22.1(GND) U23.1(GND) VR1.2 VR4.3(GROUND) VR4.6(TAB_GND)
MAIN: C30.1 C32.1 R6.2 U9.2(OUT)
NetC3_1: C3.1 ICL1.2(CAP+)
NetC3_2: C3.2 ICL1.4(CAP-)
NetC6_1: C6.1 C7.1 C8.1 U4.3(Vin) Z1.1
NetC10_1: C10.1 L2.1 TVS8.1 U4.4(+V0)
NetC73_1: C73.1 R93.1
NetD3_1: D3.1 L1.2 L3.3 TVS7.1
NetF1_2: F1.2 L1.1
NetL3_4: L3.4 Z1.2
NetL6_2: L6.2 VR4.4(SWITCH) Z2.2
NetR6_1: R6.1 R7.2 U9.1(ADJ)
NetR49_1: R49.1 R92.2 VR4.2(FEEDBACK)
NetR93_2: R93.2 VR4.1(COMP)

Not connected (* = marked no-connect by the designer): ICL1 1(TEST)* 6(LV)* 7(OSC)*; U4 1(Ctrl) 5(No_Pin)

### Notes on the sheet
- THIS DOCUMENT AND THE DATA DISCLOSED HEREIN OR
- HEREWITH IS THE PROPERTY OF ALTIUM LIMITED AND MAY
- DWG NO:
- REVISION
- REV:
- DESCRIPTION
- DATE
- APPROVED
- BE FREELY DISTRIBUTED IN WHOLE. NO RIGHTS ARE
- RESERVED OR EXPRESS OR IMPLIED WARANTEE GIVEN.
- ENG:
- APPROVALS
- PROJECT
- DSN:
- CHK:
- REFERENCE DOCUMENTS
- PROJECT REVISION:
- TITLE
- DOCUMENT REVISION:
- DESIGN ITEM:
- BOM:
- FAB DWG:
- PCB DWG:
- ASSY DWG:
- SCALE:
- A3
- SIZE
- CAGE CODE
- FILE NAME
- DWG NO.
- SHEET
- OF
- REV

### Library data of the parts
C3 C4 C6 C7 C10 C11 C15 C17 C18 C21 C22 C25 C26 C29 C30 C38 C67 C69 C71 C77 C78 C81 C82 = Polarized Capacitor
C8 C13 C14 C16 C19 C20 C23 C24 C27 C28 C31 C32 C41 C47 C70 C72-C74 C79 C80 C83 C84 = Ceramic Capacitor: as C1 on sheet IoT_Board_ESP32; Kieu_Chan: *
D3 = Diode: as D10 on sheet RTC; Ghi_Chu: *; Kieu_Chan: *
F1 = Fuse: Designed by: VanDungEvn; Value: Fuse
L1 L2 L6 = CUON CAM 100uH SMD: Dán; Don_Vi: Con; Ma_Hang: MH003999; Ten_Linh_Kien: Cuộn Cảm 100uH 7x7x4MM CD74; Ma_Hang: *; Kieu_Chan: *; Chung_Loai: Dán
L3 = inductor_1: Common mode choke / cuon cam xuyen
R6 R7 R49 R92 R93 = Resistor: as R3 on sheet IoT_Board_ESP32; Kieu_Chan: *
TVS7 TVS8 TVS21 = TVS Uni Diode
U5-U8 U22 U23 = LM1117-3V3: Value: AMS1117-3.3V SOT223; Don_Vi: Con; Ma_Hang: MH000596; Chung_Loai: Dán; Ghi_Chu: *; Kieu_Chan: *
U9 = LM1117-ADJ: 800mA Low-Dropout Linear Regulator; Creator: Nguyen Ba Bien; Website: http://group3i.net
VR1 = Varistor
VR4 = LM2577S-ADJ: SIMPLE SWITCHER&reg; 3.5V to 40V, 3A Low Component Count Step-Up Regulator 5-DDPAK/TO-263 -40 to 125; MF: Texas Instruments; Price: None; Package: TO-263-5 Texas Instruments; Purchase-URL: https://pricing.snapeda.com/search/part/LM2577S-ADJ/?ref=eda; Availability: In Stock; SnapEDA_Link: https://www.snapeda.com/parts/LM2577S-ADJ/Texas+Instruments/view-part/?ref=snap; Value: *; MP: LM2577S-ADJ; Check_prices: https://www.snapeda.com/parts/LM2577S-ADJ/Texas+Instruments/view-part/?ref=eda
Z1 Z2 = Zenner Diode: MP: 1SMA5926; MF: Taiwan Semiconductor; Package: SMA-2 Taiwan Semiconductor; Availability: In Stock; Purchase-URL: https://pricing.snapeda.com/search/part/1SMA5926/?ref=eda; SnapEDA_Link: https://www.snapeda.com/parts/1SMA5926/Taiwan+Semiconductor/view-part/?ref=snap; Price: None; Check_prices: https://www.snapeda.com/parts/1SMA5926/Taiwan+Semiconductor/view-part/?ref=eda; Value: *

## Sheet RS485.SchDoc
size A; SheetNumber: 10; SheetTotal: 13
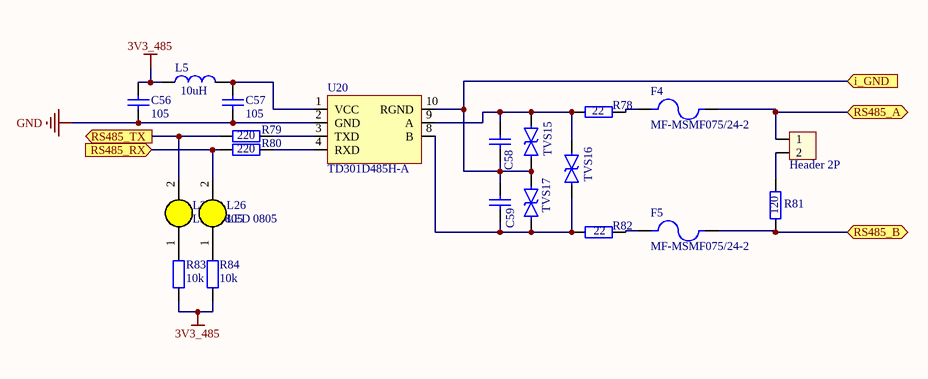
[diagram p5: RS485.SchDoc]

### Parts
C56  105  [0603_Cap]
C57  105  [0603_Cap]
C58  101  [0603_Cap]  (value not drawn)
C59  101  [0603_Cap]  (value not drawn)
F4  MF-MSMF075/24-2  [FUSER_MF-MSMF075/24-2]
F5  MF-MSMF075/24-2  [FUSER_MF-MSMF075/24-2]
H24  Header 2P  [JP 1x2]
L5  10uH  [0603_Inductor]
L25  LED 0805  [LED-0805-Yellow]
L26  LED 0805  [LED-0805-Yellow]
R78  22  [0603_Res]
R79  220  [0603_Res]
R80  220  [0603_Res]
R81  120  [0603_Res]
R82  22  [0603_Res]
R83  10k  [0603_Res]
R84  10k  [0603_Res]
TVS15  SMBJ12CA  [SMB - DO-214AA]  (value not drawn)
TVS16  SMBJ12CA  [SMB - DO-214AA]  (value not drawn)
TVS17  SMBJ12CA  [SMB - DO-214AA]  (value not drawn)
U20  TD301D485H-A  [TD301D485H-A]

### Ports
i_GND (in), RS485_A (bidir), RS485_B (bidir), RS485_RX (in), RS485_TX (out)

### Nets
3V3_485: C56.1 L5.1 R83.2 R84.2
GND: C56.2 C57.2 U20.2(GND)
RS485_A: F4.2 H24.1 ; port RS485_A
RS485_B: F5.2 R81.2 ; port RS485_B
RS485_GND: C58.2 C59.1 TVS15.1 TVS17.2 U20.10(RGND) ; port i_GND
UART2_RX_STM32: L25.2(K) R79.1 ; port RS485_TX
UART2_TX_STM32: L26.2(K) R80.1 ; port RS485_RX
NetC57_1: C57.1 L5.2 U20.1(VCC)
NetC58_1: C58.1 R78.2 TVS15.2 TVS16.2 U20.9(A)
NetC59_2: C59.2 R82.2 TVS16.1 TVS17.1 U20.8(B)
NetF4_1: F4.1 R78.1
NetF5_1: F5.1 R82.1
NetH24_2: H24.2 R81.1
NetL25_1: L25.1(A) R83.1
NetL26_1: L26.1(A) R84.1
NetR79_2: R79.2 U20.3(TXD)
NetR80_2: R80.2 U20.4(RXD)

### Library data of the parts
C56-C59 = Ceramic Capacitor: as C1 on sheet IoT_Board_ESP32; Kieu_Chan: *
F4 F5 = MF-MSMF075/24-2: Polymeric PTC Resettable Fuse 24V 750 mA Ih Surface Mount 1812 (4532 Metric), Concave; MF: Bourns; Value: *; Check_prices: https://www.snapeda.com/parts/MF-MSMF075/24-2/Bourns/view-part/?ref=eda; Availability: In Stock; Price: None; MP: MF-MSMF075/24-2; Package: 1812 Bourns; SnapEDA_Link: https://www.snapeda.com/parts/MF-MSMF075/24-2/Bourns/view-part/?ref=snap; Purchase-URL: https://pricing.snapeda.com/search/part/MF-MSMF075/24-2/?ref=eda
H24 = Header 2P: THT; Ten_Linh_Kien: Header 2P XH2.54-2P Đực Cong; Don_Vi: Con; Ma_Hang: MH002852; Chung_Loai: Cắm
L5 = Inductor: Inductors from EPCOS include SMT Inductors, SMT Power Inductors, Transponder Coils, ISDN Transformers, xDSL Transformers, DC/DC Converters, RF Transformers and SMT Current Sense Transformers.; MP: B82477G4472M000; Price: None; SnapEDA_Link: https://www.snapeda.com/parts/B82477G4472M000/EPCOS/view-part/?ref=snap; Package: NON STANDARD-2 EPCOS; Value: *; Check_prices: https://www.snapeda.com/parts/B82477G4472M000/EPCOS/view-part/?ref=eda; Availability: In Stock; MF: EPCOS; Purchase-URL: https://pricing.snapeda.com/search/part/B82477G4472M000/?ref=eda
L25 L26 = LED 0805 Vang: Dán; Don_Vi: Con; Ma_Hang: MH002329; Ten_Linh_Kien: LED 0805 Màu Vàng ( Yellow); Ghi_Chu: *; Kieu_Chan: *; Chung_Loai: Dán
R78-R84 = Resistor: as R3 on sheet IoT_Board_ESP32; Kieu_Chan: *
TVS15-TVS17 = TVS Bi Diode
U20 = TD301D485H-A: TTL to RS485

## Sheet SD_card.SchDoc
size A; SheetNumber: 7; SheetTotal: 12
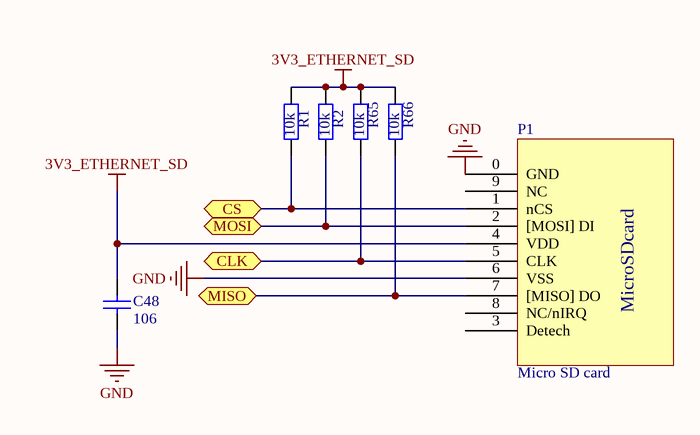
[diagram p6: SD_card.SchDoc]

### Parts
C48  106  [0603_Cap]
P1  Micro SD card  [MicroSD]
R1  10k  [0603_Res]
R2  10k  [0603_Res]
R65  10k  [0603_Res]
R66  10k  [0603_Res]

### Ports
CLK (bidir), CS (bidir), MISO (bidir), MOSI (bidir)

### Nets
3V3_ETHERNET_SD: C48.1 P1.4(VDD) R1.2 R2.2 R65.2 R66.2
GND: C48.2 P1.0(GND) P1.6(VSS)
SPI_CS1_ESP32: P1.1(nCS) R1.1 ; port CS
SPI_MISO_ESP32: P1.7([MISO]_DO) R66.1 ; port MISO
SPI_MOSI_ESP32: P1.2([MOSI]_DI) R2.1 ; port MOSI
SPI_SCK_ESP32: P1.5(CLK) R65.1 ; port CLK

Not connected (* = marked no-connect by the designer): P1 3(Detech) 8(NC/nIRQ) 9(NC)

### Notes on the sheet
- (in symbol Micro SD card) MicroSDcard

### Library data of the parts
C48 = Ceramic Capacitor: as C1 on sheet IoT_Board_ESP32; Kieu_Chan: *
R1 R2 R65 R66 = Resistor: as R3 on sheet IoT_Board_ESP32; Kieu_Chan: *

## Sheet DO.SchDoc
size 420 x 297 mm; SheetNumber: 5; SheetTotal: 13
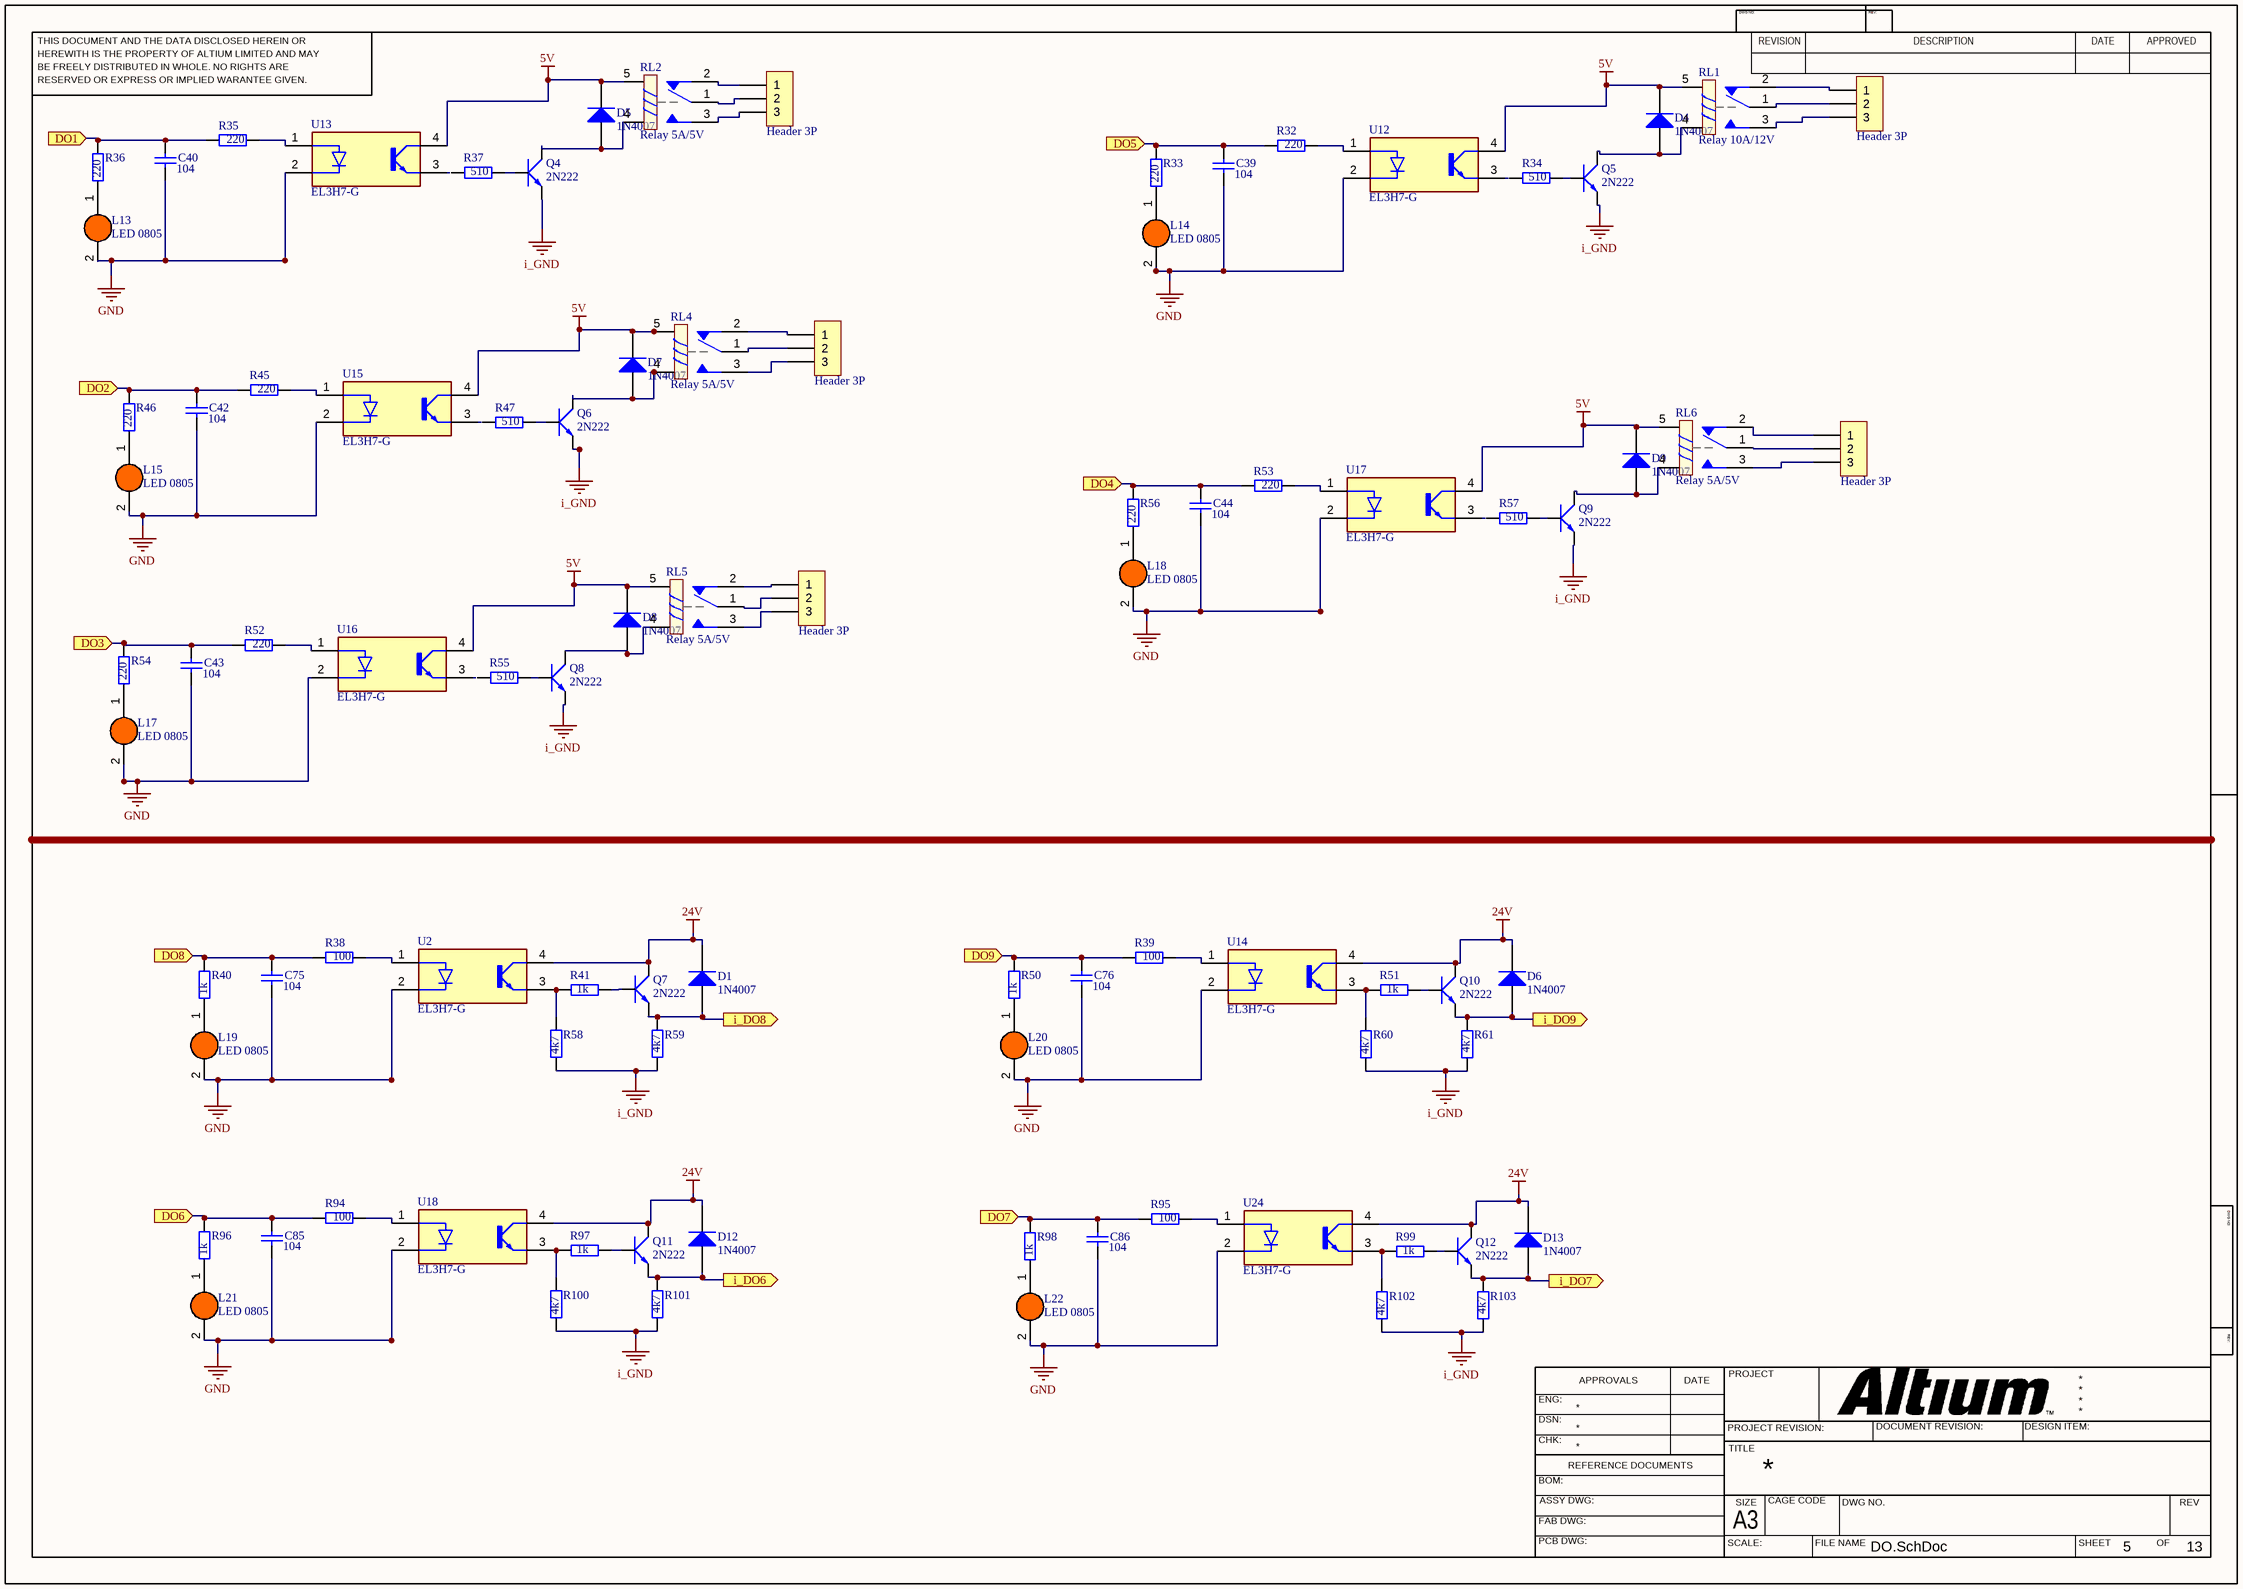
[diagram p7: DO.SchDoc]

### Parts
C39  104  [0603_Cap]
C40  104  [0603_Cap]
C42  104  [0603_Cap]
C43  104  [0603_Cap]
C44  104  [0603_Cap]
C75  104  [0603_Cap]
C76  104  [0603_Cap]
C85  104  [0603_Cap]
C86  104  [0603_Cap]
D1  1N4007  [SMA - DO-214AC]
D4  1N4007  [SMA - DO-214AC]
D5  1N4007  [SMA - DO-214AC]
D6  1N4007  [SMA - DO-214AC]
D7  1N4007  [SMA - DO-214AC]
D8  1N4007  [SMA - DO-214AC]
D9  1N4007  [SMA - DO-214AC]
D12  1N4007  [SMA - DO-214AC]
D13  1N4007  [SMA - DO-214AC]
H17  Header 3P  [CON 3 EDG5.08-3P]
H18  Header 3P  [CON 3 EDG5.08-3P]
H20  Header 3P  [CON 3 EDG5.08-3P]
H21  Header 3P  [CON 3 EDG5.08-3P]
H22  Header 3P  [CON 3 EDG5.08-3P]
L13  LED 0805  [LED-0805-Orange]
L14  LED 0805  [LED-0805-Orange]
L15  LED 0805  [LED-0805-Orange]
L17  LED 0805  [LED-0805-Orange]
L18  LED 0805  [LED-0805-Orange]
L19  LED 0805  [LED-0805-Orange]
L20  LED 0805  [LED-0805-Orange]
L21  LED 0805  [LED-0805-Orange]
L22  LED 0805  [LED-0805-Orange]
Q4  2N222  [SOT23-231]
Q5  2N222  [SOT23-231]
Q6  2N222  [SOT23-231]
Q7  2N222  [SOT23-231]
Q8  2N222  [SOT23-231]
Q9  2N222  [SOT23-231]
Q10  2N222  [SOT23-231]
Q11  2N222  [SOT23-231]
Q12  2N222  [SOT23-231]
R32  220  [0603_Res]
R33  220  [0603_Res]
R34  510  [0603_Res]
R35  220  [0603_Res]
R36  220  [0603_Res]
R37  510  [0603_Res]
R38  100  [0603_Res]
R39  100  [0603_Res]
R40  1k  [0603_Res]
R41  1k  [0603_Res]
R45  220  [0603_Res]
R46  220  [0603_Res]
R47  510  [0603_Res]
R50  1k  [0603_Res]
R51  1k  [0603_Res]
R52  220  [0603_Res]
R53  220  [0603_Res]
R54  220  [0603_Res]
R55  510  [0603_Res]
R56  220  [0603_Res]
R57  510  [0603_Res]
R58  4k7  [0603_Res]
R59  4k7  [0603_Res]
R60  4k7  [0603_Res]
R61  4k7  [0603_Res]
R94  100  [0603_Res]
R95  100  [0603_Res]
R96  1k  [0603_Res]
R97  1k  [0603_Res]
R98  1k  [0603_Res]
R99  1k  [0603_Res]
R100  4k7  [0603_Res]
R101  4k7  [0603_Res]
R102  4k7  [0603_Res]
R103  4k7  [0603_Res]
RL1  Relay 10A/12V  [RL_SPDT_10A]
RL2  Relay 5A/5V  [RL_SPDT_10A]
RL4  Relay 5A/5V  [RL_SPDT_10A]
RL5  Relay 5A/5V  [RL_SPDT_10A]
RL6  Relay 5A/5V  [RL_SPDT_10A]
U2  EL3H7-G  [SSOP-4]
U12  EL3H7-G  [SSOP-4]
U13  EL3H7-G  [SSOP-4]
U14  EL3H7-G  [SSOP-4]
U15  EL3H7-G  [SSOP-4]
U16  EL3H7-G  [SSOP-4]
U17  EL3H7-G  [SSOP-4]
U18  EL3H7-G  [SSOP-4]
U24  EL3H7-G  [SSOP-4]

### Ports
DO1 (in), DO2 (in), DO3 (in), DO4 (in), DO5 (in), DO6 (in), DO7 (in), DO8 (in), DO9 (in), i_DO6 (out), i_DO7 (out), i_DO8 (out), i_DO9 (out)

### Nets
5V: D4.1 D5.1 D7.1 D8.1 D9.1 RL1.5 RL2.5 RL4.5 RL5.5 RL6.5 U12.4(CO) U13.4(CO) U15.4(CO) U16.4(CO) U17.4(CO)
24V: D1.1 D6.1 D12.1 D13.1 Q7.3(C) Q10.3(C) Q11.3(C) Q12.3(C) U2.4(CO) U14.4(CO) U18.4(CO) U24.4(CO)
GND: C39.2 C40.2 C42.2 C43.2 C44.2 C75.2 C76.2 C85.2 C86.2 L13.2(K) L14.2(K) L15.2(K) L17.2(K) L18.2(K) L19.2(K) L20.2(K) L21.2(K) L22.2(K) U2.2(C) U12.2(C) U13.2(C) U14.2(C) U15.2(C) U16.2(C) U17.2(C) U18.2(C) U24.2(C)
i_GND: Q4.1(E) Q5.1(E) Q6.1(E) Q8.1(E) Q9.1(E) R58.1 R59.1 R60.1 R61.1 R100.1 R101.1 R102.1 R103.1
DO1: C40.1 R35.1 R36.2 ; port DO1
DO2: C42.1 R45.1 R46.2 ; port DO2
DO3: C43.1 R52.1 R54.2 ; port DO3
DO4: C44.1 R53.1 R56.2 ; port DO4
DO5: C39.1 R32.1 R33.2 ; port DO5
DO6: C85.1 R94.1 R96.2 ; port DO6
DO7: C86.1 R95.1 R98.2 ; port DO7
DO8: C75.1 R38.1 R40.2 ; port DO8
DO9: C76.1 R39.1 R50.2 ; port DO9
NetD1_2: D1.2 Q7.1(E) R59.2 ; port i_DO8
NetD4_2: D4.2 Q5.3(C) RL1.4
NetD5_2: D5.2 Q4.3(C) RL2.4
NetD6_2: D6.2 Q10.1(E) R61.2 ; port i_DO9
NetD7_2: D7.2 Q6.3(C) RL4.4
NetD8_2: D8.2 Q8.3(C) RL5.4
NetD9_2: D9.2 Q9.3(C) RL6.4
NetD12_2: D12.2 Q11.1(E) R101.2 ; port i_DO6
NetD13_2: D13.2 Q12.1(E) R103.2 ; port i_DO7
NetH17_1: H17.1 RL1.2
NetH17_2: H17.2 RL1.1
NetH17_3: H17.3 RL1.3
NetH18_1: H18.1 RL2.2
NetH18_2: H18.2 RL2.1
NetH18_3: H18.3 RL2.3
NetH20_1: H20.1 RL4.2
NetH20_2: H20.2 RL4.1
NetH20_3: H20.3 RL4.3
NetH21_1: H21.1 RL5.2
NetH21_2: H21.2 RL5.1
NetH21_3: H21.3 RL5.3
NetH22_1: H22.1 RL6.2
NetH22_2: H22.2 RL6.1
NetH22_3: H22.3 RL6.3
NetL13_1: L13.1(A) R36.1
NetL14_1: L14.1(A) R33.1
NetL15_1: L15.1(A) R46.1
NetL17_1: L17.1(A) R54.1
NetL18_1: L18.1(A) R56.1
NetL19_1: L19.1(A) R40.1
NetL20_1: L20.1(A) R50.1
NetL21_1: L21.1(A) R96.1
NetL22_1: L22.1(A) R98.1
NetQ4_2: Q4.2(B) R37.2
NetQ5_2: Q5.2(B) R34.2
NetQ6_2: Q6.2(B) R47.2
NetQ7_2: Q7.2(B) R41.2
NetQ8_2: Q8.2(B) R55.2
NetQ9_2: Q9.2(B) R57.2
NetQ10_2: Q10.2(B) R51.2
NetQ11_2: Q11.2(B) R97.2
NetQ12_2: Q12.2(B) R99.2
NetR32_2: R32.2 U12.1(A)
NetR35_2: R35.2 U13.1(A)
NetR38_2: R38.2 U2.1(A)
NetR39_2: R39.2 U14.1(A)
NetR41_1: R41.1 R58.2 U2.3(E)
NetR45_2: R45.2 U15.1(A)
NetR51_1: R51.1 R60.2 U14.3(E)
NetR52_2: R52.2 U16.1(A)
NetR53_2: R53.2 U17.1(A)
NetR94_2: R94.2 U18.1(A)
NetR95_2: R95.2 U24.1(A)
NetR97_1: R97.1 R100.2 U18.3(E)
NetR99_1: R99.1 R102.2 U24.3(E)

Not connected (* = marked no-connect by the designer): R34 1; R37 1; R47 1; R55 1; R57 1; U12 3(E); U13 3(E); U15 3(E); U16 3(E); U17 3(E)

### Notes on the sheet
- THIS DOCUMENT AND THE DATA DISCLOSED HEREIN OR
- HEREWITH IS THE PROPERTY OF ALTIUM LIMITED AND MAY
- DWG NO:
- REVISION
- REV:
- DESCRIPTION
- DATE
- APPROVED
- BE FREELY DISTRIBUTED IN WHOLE. NO RIGHTS ARE
- RESERVED OR EXPRESS OR IMPLIED WARANTEE GIVEN.
- ENG:
- APPROVALS
- PROJECT
- DSN:
- CHK:
- REFERENCE DOCUMENTS
- PROJECT REVISION:
- TITLE
- DOCUMENT REVISION:
- DESIGN ITEM:
- BOM:
- FAB DWG:
- PCB DWG:
- ASSY DWG:
- SCALE:
- A3
- SIZE
- CAGE CODE
- FILE NAME
- DWG NO.
- SHEET
- OF
- REV

### Library data of the parts
C39 C40 C42-C44 C75 C76 C85 C86 = Ceramic Capacitor: as C1 on sheet IoT_Board_ESP32; Kieu_Chan: *
D1 D4-D9 D12 D13 = Diode: as D10 on sheet RTC; Ghi_Chu: *; Kieu_Chan: *
H17 H18 H20-H22 = Header 3P: as H2 on sheet IoT_Board_ESP32
L13-L15 L17-L22 = LED 0805 Cam: Dán; Don_Vi: Con; Ma_Hang: MH002328; Ten_Linh_Kien: LED 0805 Màu Cam ( Orange); Ghi_Chu: *; Kieu_Chan: *; Chung_Loai: Dán
Q4-Q12 = 2N222: NPN 600mW, ECB; Value: C1815
R32-R41 R45-R47 R50-R61 R94-R103 = Resistor: as R3 on sheet IoT_Board_ESP32; Kieu_Chan: *
RL1 RL2 RL4-RL6 = Relay 1: Relay SPDT,10A - 12VDC 5 Pin; Value: Relay SPDT, 10A, 12V
U2 U12-U18 U24 = EL3H7-G: Optoisolator Transistor Output 3750Vrms 1 Channel 4-SSOP; MF: Everlight Electronics; Check_prices: https://www.snapeda.com/parts/EL3H7-G/Everlight+Electronics+Co+Ltd/view-part/?ref=eda; Value: *; Availability: In Stock; MP: EL3H7-G; Price: None; Package: SSOP-4 Everlight Electronics; SnapEDA_Link: https://www.snapeda.com/parts/EL3H7-G/Everlight+Electronics+Co+Ltd/view-part/?ref=snap

## Sheet SIM_CARD.SchDoc
size A; SheetNumber: 8; SheetTotal: 13
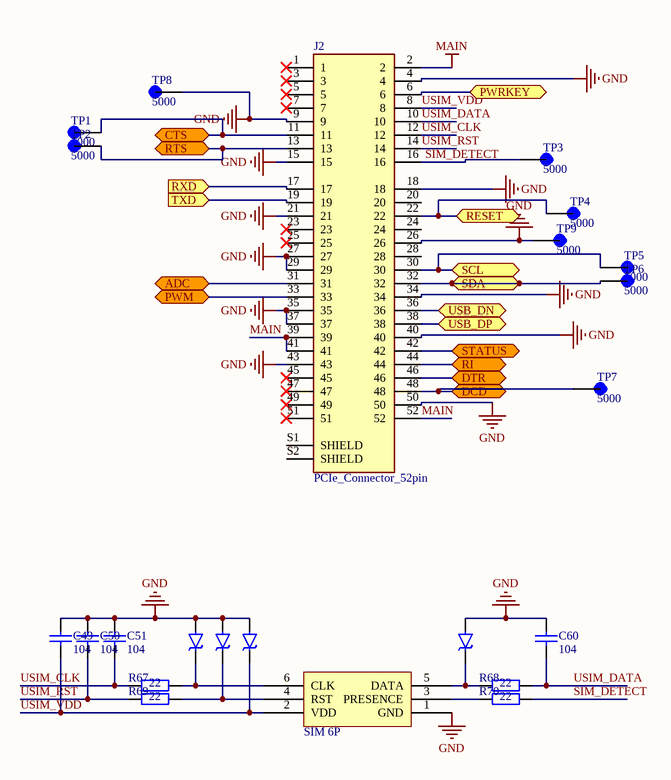
[diagram p8: SIM_CARD.SchDoc]

### Parts
C49  104  [tu 0603]
C50  104  [tu 0603]
C51  104  [tu 0603]
C60  104  [tu 0603]
J2  PCIe_Connector_52pin  [MOLEX_67910-0002]
R67  22  [tro smd 0603]
R68  22  [tro smd 0603]
R69  22  [tro smd 0603]
R70  22  [tro smd 0603]
SIM1  SIM 6P  [sim6]
TP1  5000  [KEYSTONE_5000]
TP2  5000  [KEYSTONE_5000]
TP3  5000  [KEYSTONE_5000]
TP4  5000  [KEYSTONE_5000]
TP5  5000  [KEYSTONE_5000]
TP6  5000  [KEYSTONE_5000]
TP7  5000  [KEYSTONE_5000]
TP8  5000  [KEYSTONE_5000]
TP9  5000  [KEYSTONE_5000]
TVS1  TVS Diode  [SMA - DO-214AC]  (value not drawn)
TVS2  TVS Diode  [SMA - DO-214AC]  (value not drawn)
TVS3  TVS Diode  [SMA - DO-214AC]  (value not drawn)
TVS4  TVS Diode  [SMA - DO-214AC]  (value not drawn)

### Ports
ADC (bidir), CTS (bidir), DCD (bidir), DTR (bidir), PWM (bidir), PWRKEY (bidir), RESET (bidir), RI (bidir), RTS (bidir), RXD (in), SCL (bidir), SDA (bidir), STATUS (bidir), TXD (in), USB_DN (bidir), USB_DP (bidir)

### Nets
GND: C49.1 C50.1 C51.1 C60.1 J2.4 J2.9 J2.15 J2.18 J2.21 J2.26 J2.27 J2.29 J2.34 J2.35 J2.37 J2.40 J2.43 J2.50 SIM1.1(GND) TP8.TP TP9.TP TVS1.2 TVS2.2 TVS3.2 TVS4.2
MAIN: J2.2 J2.39 J2.41 J2.52
I2C_SCL_ESP: J2.30 TP5.TP ; port SCL
I2C_SDA_ESP: J2.32 TP6.TP ; port SDA
IO01: J2.6 ; port PWRKEY
IO02: J2.22 TP4.TP ; port RESET
IO03: J2.44 ; port RI
IO04: J2.46 ; port DTR
IO05: J2.48 TP7.TP ; port DCD
IO06: J2.31 ; port ADC
IO07: J2.33 ; port PWM
IO14: J2.42 ; port STATUS
SIM_DETECT: J2.16 R70.1 TP3.TP
U0CTS: J2.13 TP2.TP ; port RTS
U0RTS: J2.11 TP1.TP ; port CTS
UART1_RX_ESP32: J2.19 ; port TXD
UART1_TX_ESP32: J2.17 ; port RXD
USB_DN: J2.36 ; port USB_DN
USB_DP: J2.38 ; port USB_DP
USIM_CLK: C51.2 J2.12 R67.2
USIM_DATA: C60.2 J2.10 R68.1
USIM_RST: C50.2 J2.14 R69.2
USIM_VDD: C49.2 J2.8 SIM1.2(VDD) TVS3.1
NetR67_1: R67.1 SIM1.6(CLK) TVS1.1
NetR68_2: R68.2 SIM1.5(DATA) TVS4.1
NetR69_1: R69.1 SIM1.4(RST) TVS2.1
NetR70_2: R70.2 SIM1.3(PRESENCE)

Not connected (* = marked no-connect by the designer): J2 1* 3* 5* 7* 20 23* 24 25* 28 45* 47* 49* 51* S1(SHIELD) S2(SHIELD)

### Library data of the parts
C49-C51 C60 = Tu 0603 104 50V 10%: Dán; Don_Vi: Con; So_Chan: 2; Ten_Linh_Kien: Tụ 0603 104-100nF 10% 50V; Ma_Hang: MH004568; Chung_Loai: Dán; Kieu_Chan: *
J2 = PCIe_Connector_52pin: 52 Position Female Connector PCI Express Mini Card Gold 0.031 _0.80mm_ Black; MF: Molex; MP: 67910-0002; SnapEDA_Link: https://www.snapeda.com/parts/67910-0002/Molex/view-part/423219/?ref=snap; Availability: Unavailable; Package: None; Value: *; Price: None
R67-R70 = Tro 0603 5% 3.3k: Dán; Don_Vi: Con; So_Chan: 2; Ten_Linh_Kien: Trở 0603 5% 3.3k; Ma_Hang: MH006332; Chung_Loai: Dán; Kieu_Chan: *
SIM1 = Khay SIM 6P
TP1-TP9 = 5000: PC Test Point - Miniature; MF: Keystone Electronics; Purchase-URL: https://pricing.snapeda.com/search/part/5000/?ref=eda; Check_prices: https://www.snapeda.com/parts/5000/Keystone+Electronics/view-part/?ref=eda; Value: *; Price: None; Availability: In Stock; Package: Test Point Keystone Electronics; MP: 5000; SnapEDA_Link: https://www.snapeda.com/parts/5000/Keystone+Electronics/view-part/?ref=snap
TVS1-TVS4 = TVS Uni Diode

## Sheet AI.SchDoc
size 420 x 297 mm; SheetNumber: 12; SheetTotal: 13
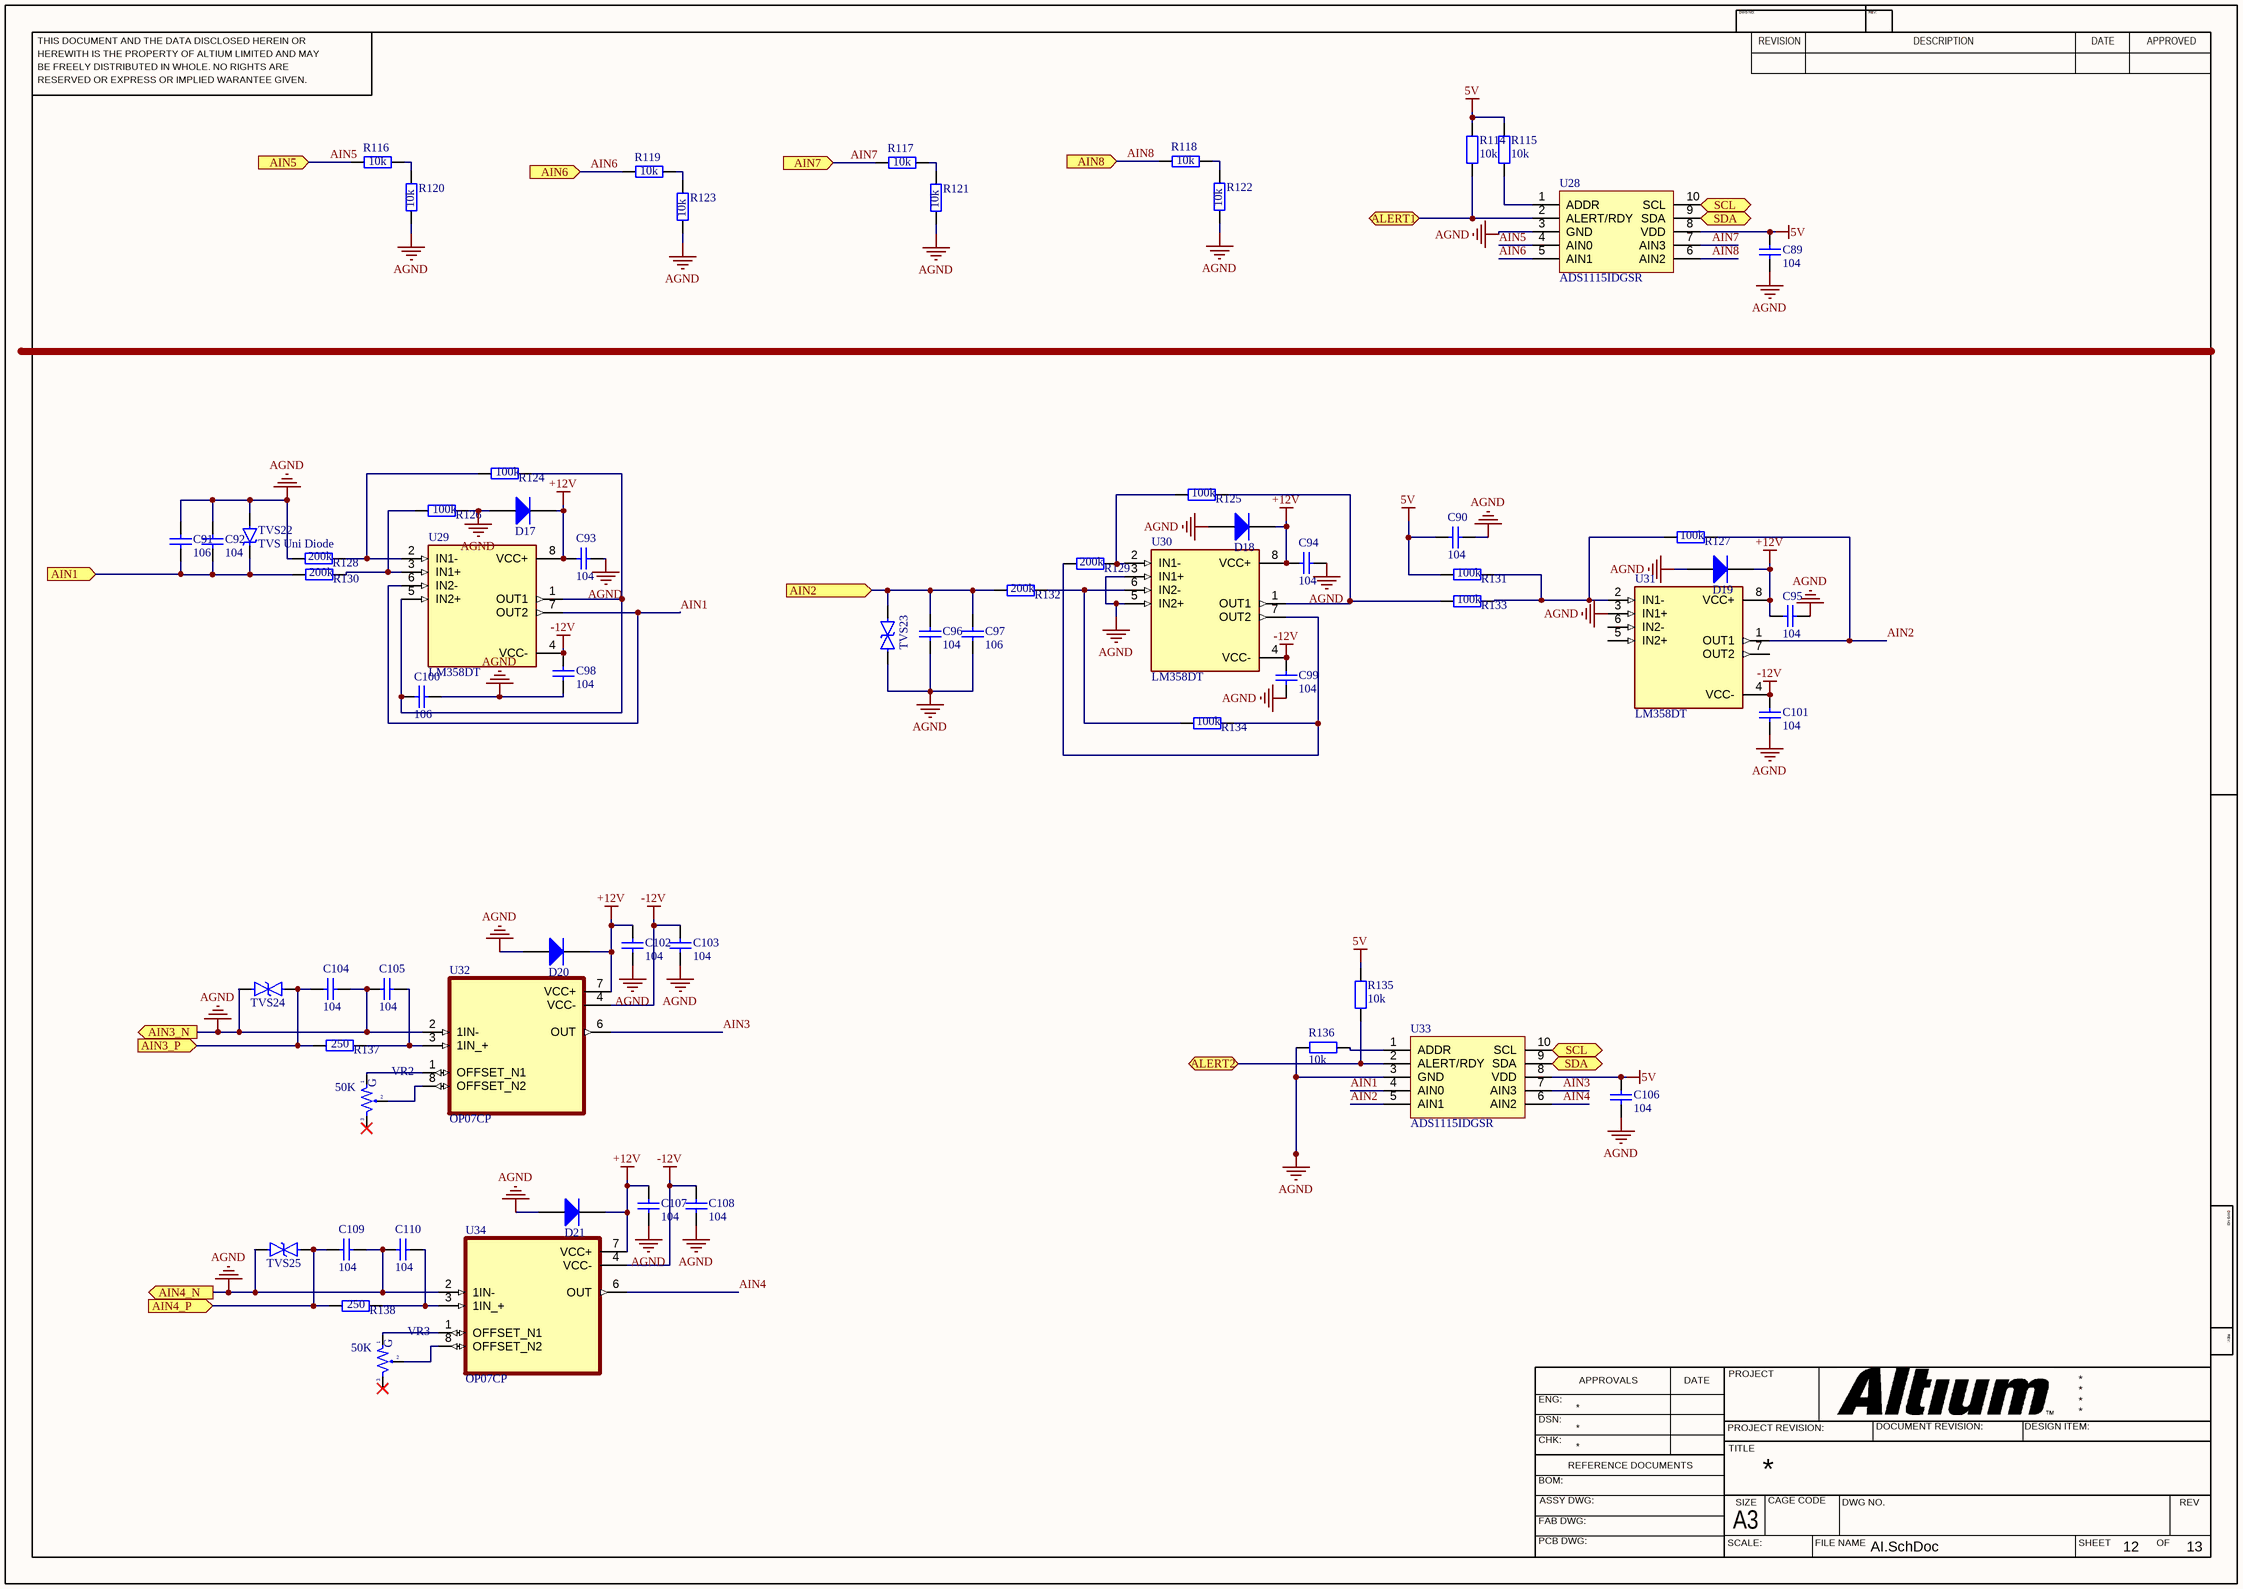
[diagram p9: AI.SchDoc]

### Parts
C89  104  [0603_Cap]
C90  104  [0603_Cap]
C91  106  [1206_CAP]
C92  104  [0603_Cap]
C93  104  [0603_Cap]
C94  104  [0603_Cap]
C95  104  [0603_Cap]
C96  104  [0603_Cap]
C97  106  [1206_CAP]
C98  104  [0603_Cap]
C99  104  [0603_Cap]
C100  106  [1206_CAP]
C101  104  [0603_Cap]
C102  104  [0603_Cap]
C103  104  [0603_Cap]
C104  104  [0603_Cap]
C105  104  [0603_Cap]
C106  104  [0603_Cap]
C107  104  [0603_Cap]
C108  104  [0603_Cap]
C109  104  [0603_Cap]
C110  104  [0603_Cap]
D17  RS3M  [SMC - DO-214]  (value not drawn)
D18  RS3M  [SMC - DO-214]  (value not drawn)
D19  RS3M  [SMC - DO-214]  (value not drawn)
D20  RS3M  [SMC - DO-214]  (value not drawn)
D21  RS3M  [SMC - DO-214]  (value not drawn)
R114  10k  [0603_Res]
R115  10k  [0603_Res]
R116  10k  [0603_Res]
R117  10k  [0603_Res]
R118  10k  [0603_Res]
R119  10k  [0603_Res]
R120  10k  [0603_Res]
R121  10k  [0603_Res]
R122  10k  [0603_Res]
R123  10k  [0603_Res]
R124  100k  [0603_Res]
R125  100k  [0603_Res]
R126  100k  [0603_Res]
R127  100k  [0603_Res]
R128  200k  [0603_Res]
R129  200k  [0603_Res]
R130  200k  [0603_Res]
R131  100k  [0603_Res]
R132  200k  [0603_Res]
R133  100k  [0603_Res]
R134  100k  [0603_Res]
R135  10k  [0603_Res]
R136  10k  [0603_Res]
R137  250  [0603_Res]
R138  250  [0603_Res]
TVS22  TVS Uni Diode  [SMA - DO-214AC]
TVS23  SMBJ12CA  [SMB - DO-214AA]  (value not drawn)
TVS24  SMBJ12CA  [SMB - DO-214AA]  (value not drawn)
TVS25  SMBJ12CA  [SMB - DO-214AA]  (value not drawn)
U28  ADS1115IDGSR  [VSOP-10_19.6_230_57X12_SMD]
U29  LM358DT  [SOIC127P600X175-8N]
U30  LM358DT  [SOIC127P600X175-8N]
U31  LM358DT  [SOIC127P600X175-8N]
U32  OP07CP  [DIP794W45P254L959H508Q8]
U33  ADS1115IDGSR  [VSOP-10_19.6_230_57X12_SMD]
U34  OP07CP  [DIP794W45P254L959H508Q8]
VR2  50K  [VR-S3]
VR3  50K  [VR-S3]

### Ports
AIN1 (in), AIN2 (in), AIN3_N (out), AIN3_P (in), AIN4_N (out), AIN4_P (in), AIN5 (in), AIN6 (in), AIN7 (in), AIN8 (in), ALERT1 (bidir), ALERT2 (bidir), SCL (bidir), SDA (bidir)

### Nets
5V: C89.2 C90.1 C106.2 R114.2 R115.2 R131.1 R135.2 U28.8(VDD) U33.8(VDD)
+12V: C93.2 C94.1 C95.1 C102.2 C107.2 D17.1 D18.1 D19.1 D20.1 D21.1 U29.8(VCC+) U30.8(VCC+) U31.8(VCC+) U32.7(VCC+) U34.7(VCC+)
-12V: C98.1 C99.1 C101.1 C103.1 C108.1 U29.4(VCC-) U30.4(VCC-) U31.4(VCC-) U32.4(VCC-) U34.4(VCC-)
AGND: C89.1 C90.2 C91.1 C92.2 C93.1 C94.2 C95.2 C96.2 C97.1 C98.2 C99.2 C100.2 C101.2 C102.1 C103.2 C104.2 C105.2 C106.1 C107.1 C108.2 C109.2 C110.2 D17.2 D18.2 D19.2 D20.2 D21.2 R120.1 R121.1 R122.1 R123.1 R126.2 R128.1 R136.1 TVS22.2 TVS23.1 TVS24.2 TVS25.2 U28.3(GND) U30.3(IN1+) U30.5(IN2+) U31.3(IN1+) U32.2(1IN-) U33.3(GND) U34.2(1IN-) ; port AIN3_N, port AIN4_N
AIN1: U29.6(IN2-) U29.7(OUT2) U33.4(AIN0)
AIN2: R127.2 U31.1(OUT1) U33.5(AIN1)
AIN3: U32.6(OUT) U33.7(AIN3)
AIN4: U33.6(AIN2) U34.6(OUT)
AIN5: R116.1 U28.4(AIN0) ; port AIN5
AIN6: R119.1 U28.5(AIN1) ; port AIN6
AIN7: R117.1 U28.7(AIN3) ; port AIN7
AIN8: R118.1 U28.6(AIN2) ; port AIN8
I2C_SCL_STM: U28.9(SDA) U28.10(SCL) U33.9(SDA) U33.10(SCL) ; port SDA, port SCL
PA11: R114.1 U28.2(ALERT/RDY) ; port ALERT1
PA12: R135.1 U33.2(ALERT/RDY) ; port ALERT2
NetC91_2: C91.2 C92.1 R130.1 TVS22.1 ; port AIN1
NetC96_1: C96.1 C97.2 R132.1 TVS23.2 ; port AIN2
NetC100_1: C100.1 R124.2 U29.1(OUT1) U29.5(IN2+)
NetC104_1: C104.1 R137.1 TVS24.1 ; port AIN3_P
NetC105_1: C105.1 R137.2 U32.3(1IN_+)
NetC109_1: C109.1 R138.1 TVS25.1 ; port AIN4_P
NetC110_1: C110.1 R138.2 U34.3(1IN_+)
NetR115_1: R115.1 U28.1(ADDR)
NetR116_2: R116.2 R120.2
NetR117_2: R117.2 R121.2
NetR118_2: R118.2 R122.2
NetR119_2: R119.2 R123.2
NetR124_1: R124.1 R128.2 U29.2(IN1-)
NetR125_1: R125.1 R129.2 U30.2(IN1-)
NetR125_2: R125.2 R133.1 U30.1(OUT1)
NetR126_1: R126.1 R130.2 U29.3(IN1+)
NetR127_1: R127.1 R131.2 R133.2 U31.2(IN1-)
NetR129_1: R129.1 R134.2 U30.7(OUT2)
NetR132_2: R132.2 R134.1 U30.6(IN2-)
NetR136_2: R136.2 U33.1(ADDR)
NetU32_1: U32.1(OFFSET_N1) VR2.1
NetU32_8: U32.8(OFFSET_N2) VR2.2
NetU34_1: U34.1(OFFSET_N1) VR3.1
NetU34_8: U34.8(OFFSET_N2) VR3.2

Not connected (* = marked no-connect by the designer): U31 5(IN2+) 6(IN2-) 7(OUT2); VR2 3*; VR3 3*

### Notes on the sheet
- THIS DOCUMENT AND THE DATA DISCLOSED HEREIN OR
- HEREWITH IS THE PROPERTY OF ALTIUM LIMITED AND MAY
- DWG NO:
- REVISION
- REV:
- DESCRIPTION
- DATE
- APPROVED
- BE FREELY DISTRIBUTED IN WHOLE. NO RIGHTS ARE
- RESERVED OR EXPRESS OR IMPLIED WARANTEE GIVEN.
- ENG:
- APPROVALS
- PROJECT
- DSN:
- CHK:
- REFERENCE DOCUMENTS
- PROJECT REVISION:
- TITLE
- DOCUMENT REVISION:
- DESIGN ITEM:
- BOM:
- FAB DWG:
- PCB DWG:
- ASSY DWG:
- SCALE:
- A3
- SIZE
- CAGE CODE
- FILE NAME
- DWG NO.
- SHEET
- OF
- REV
- (in symbol VR-S) G

### Library data of the parts
C89-C110 = Ceramic Capacitor: as C1 on sheet IoT_Board_ESP32; Kieu_Chan: *
D17-D21 = Diode: as D10 on sheet RTC; Ghi_Chu: *; Kieu_Chan: *
R114-R138 = Resistor: as R3 on sheet IoT_Board_ESP32; Kieu_Chan: *
TVS23-TVS25 = TVS Bi Diode
U28 U33 = IC_ADS1115IDGSR: Analog to Digital Converters - ADC 16B ADC w/ Int MUX PGA Comp Osc & Ref; Manufacturer: Texas Instruments; Alternate Part Number-1: NA; Manufacturer Part Number: ADS1115IDGSR; Case/Package: MSOP-10; Supplier-1: Mouser; Supplier Part Number-1: 595-ADS1115IDGSR
U29-U31 = LM358DT: General Purpose Amplifier 2 Circuit 8-SO; MF: STMicroelectronics; Price: None; Package: SOIC-8 STMicroelectronics; MP: LM358DT; Value: *; Availability: Unavailable; SnapEDA_Link: https://www.snapeda.com/parts/LM358DT/STMicroelectronics/view-part/6634/?ref=snap
U32 U34 = OP07CP: Low-Offset Voltage Operational Amplifier; MF: Texas Instruments; Package: PDIP-8 Texas Instruments; Availability: Unavailable; Texas_Instruments-Purchase-URL: https://snapeda.com/shop?store=Texas+Instruments&id=558076; MP: OP07CP; DigiKey-Purchase-URL: https://snapeda.com/shop?store=DigiKey&id=558076; Value: *; Price: None; SnapEDA_Link: https://www.snapeda.com/parts/OP07CP/Texas%20Instruments/view-part/558076/?ref=snap; Mouser-Purchase-URL: https://snapeda.com/shop?store=Mouser&id=558076
VR2 VR3 = VR-S: Var Resistor; Value: Volume 50k

## Sheet BUZZER.SchDoc
size A; SheetNumber: 12; SheetTotal: 12
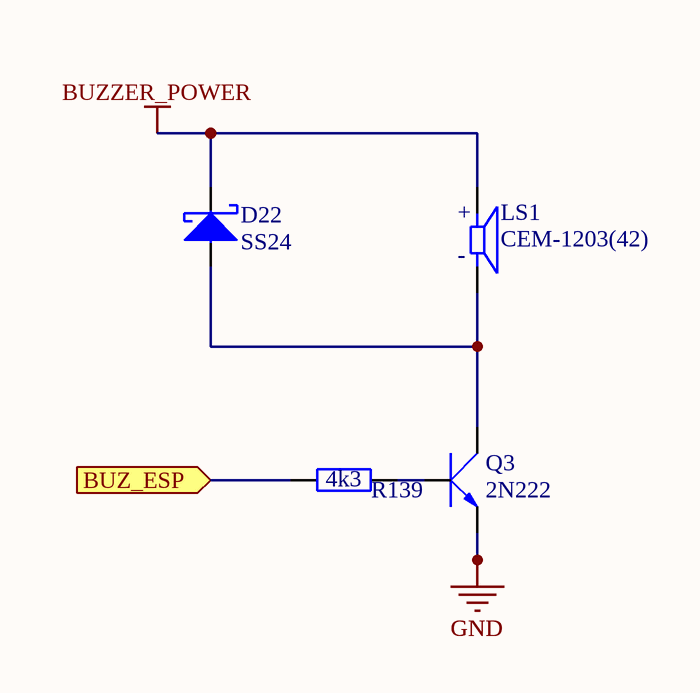
[diagram p10: BUZZER.SchDoc]

### Parts
D22  SS24  [DIO-SMD-106]
LS1  CEM-1203(42)  [CUI_CEM-1203(42)]
Q3  2N222  [SOT23-231]
R139  4k3  [0603_Res]

### Ports
BUZ_ESP (in)

### Nets
BUZZER_POWER: D22.2 LS1.P
GND: Q3.1(E)
IO45: R139.1 ; port BUZ_ESP
NetD22_1: D22.1 LS1.N Q3.3(C)
NetQ3_2: Q3.2(B) R139.2

### Notes on the sheet
- (in symbol CEM-1203(42)) +; -

### Library data of the parts
D22 = Diode Schottky: Part Number: LED 3 ly Single Colour; Pricing: *
LS1 = CEM-1203(42): 12 mm, 3.5 V, 85 dB, Through Hole, Magnetic Audio Transducer Buzzer; MF: CUI Devices; Package: None; Price: None; Check_prices: https://www.snapeda.com/parts/CEM-1203(42)/CUI+Devices/view-part/?ref=eda; Value: *; CUI_purchase_URL: https://www.cuidevices.com/product/audio/buzzers/audio-transducers/cem-1203(42)?utm_source=snapeda.com&utm_medium=referral&utm_campaign=snapedaBOM; SnapEDA_Link: https://www.snapeda.com/parts/CEM-1203(42)/CUI+Devices/view-part/?ref=snap; MP: CEM-1203(42); Availability: In Stock; Purchase-URL: https://pricing.snapeda.com/search/part/CEM-1203(42)/?ref=eda
Q3 = 2N222: NPN 600mW, ECB; Value: C1815
R139 = Resistor: as R3 on sheet IoT_Board_ESP32; Kieu_Chan: *

## Sheet RS232.SchDoc
size A; SheetNumber: 9; SheetTotal: 13
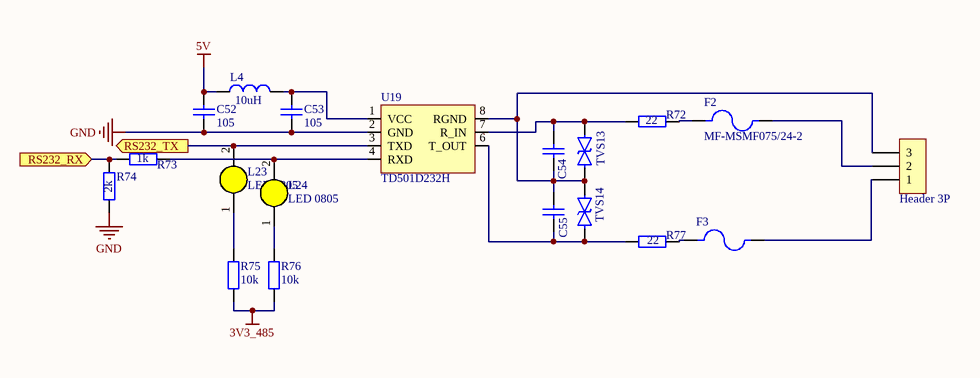
[diagram p11: RS232.SchDoc]

### Parts
C52  105  [0603_Cap]
C53  105  [0603_Cap]
C54  101  [0603_Cap]  (value not drawn)
C55  101  [0603_Cap]  (value not drawn)
F2  MF-MSMF075/24-2  [FUSER_MF-MSMF075/24-2]
F3  MF-MSMF075/24-2  [FUSER_MF-MSMF075/24-2]  (value not drawn)
H23  Header 3P  [CON 3 EDG5.08-3P]
L4  10uH  [0603_Inductor]
L23  LED 0805  [LED-0805-Yellow]
L24  LED 0805  [LED-0805-Yellow]
R72  22  [0603_Res]
R73  1k  [0603_Res]
R74  2k  [0603_Res]
R75  10k  [0603_Res]
R76  10k  [0603_Res]
R77  22  [0603_Res]
TVS13  SMBJ12CA  [SMB - DO-214AA]  (value not drawn)
TVS14  SMBJ12CA  [SMB - DO-214AA]  (value not drawn)
U19  TD501D232H  [TD501D232H]

### Ports
RS232_RX (in), RS232_TX (out)

### Nets
3V3_485: R75.2 R76.2
5V: C52.1 L4.1
GND: C52.2 C53.2 R74.1 U19.2(GND)
UART1_RX_STM32: L23.2(K) U19.3(TXD) ; port RS232_TX
UART1_TX_STM32: R73.1 R74.2 ; port RS232_RX
NetC53_1: C53.1 L4.2 U19.1(VCC)
NetC54_1: C54.1 R72.2 TVS13.2 U19.7(R_IN)
NetC54_2: C54.2 C55.1 H23.3 TVS13.1 TVS14.2 U19.8(RGND)
NetC55_2: C55.2 R77.2 TVS14.1 U19.6(T_OUT)
NetF2_1: F2.1 R72.1
NetF2_2: F2.2 H23.2
NetF3_1: F3.1 R77.1
NetF3_2: F3.2 H23.1
NetL23_1: L23.1(A) R75.1
NetL24_1: L24.1(A) R76.1
NetL24_2: L24.2(K) R73.2 U19.4(RXD)

### Library data of the parts
C52-C55 = Ceramic Capacitor: as C1 on sheet IoT_Board_ESP32; Kieu_Chan: *
F2 F3 = MF-MSMF075/24-2: as F4 on sheet RS485; Value: *; Check_prices: https://www.snapeda.com/parts/MF-MSMF075/24-2/Bourns/view-part/?ref=eda; Availability: In Stock; Price: None; MP: MF-MSMF075/24-2; Package: 1812 Bourns; SnapEDA_Link: https://www.snapeda.com/parts/MF-MSMF075/24-2/Bourns/view-part/?ref=snap; Purchase-URL: https://pricing.snapeda.com/search/part/MF-MSMF075/24-2/?ref=eda
H23 = Header 3P: as H2 on sheet IoT_Board_ESP32
L4 = Inductor: as L5 on sheet RS485; Price: None; SnapEDA_Link: https://www.snapeda.com/parts/B82477G4472M000/EPCOS/view-part/?ref=snap; Package: NON STANDARD-2 EPCOS; Value: *; Check_prices: https://www.snapeda.com/parts/B82477G4472M000/EPCOS/view-part/?ref=eda; Availability: In Stock; MF: EPCOS; Purchase-URL: https://pricing.snapeda.com/search/part/B82477G4472M000/?ref=eda
L23 L24 = LED 0805 Vang: as L25 on sheet RS485; Ghi_Chu: *; Kieu_Chan: *; Chung_Loai: Dán
R72-R77 = Resistor: as R3 on sheet IoT_Board_ESP32; Kieu_Chan: *
TVS13 TVS14 = TVS Bi Diode